# EasyEDA Pro project ProPrj_IRIS_2026-05-03.epro, board PCB1
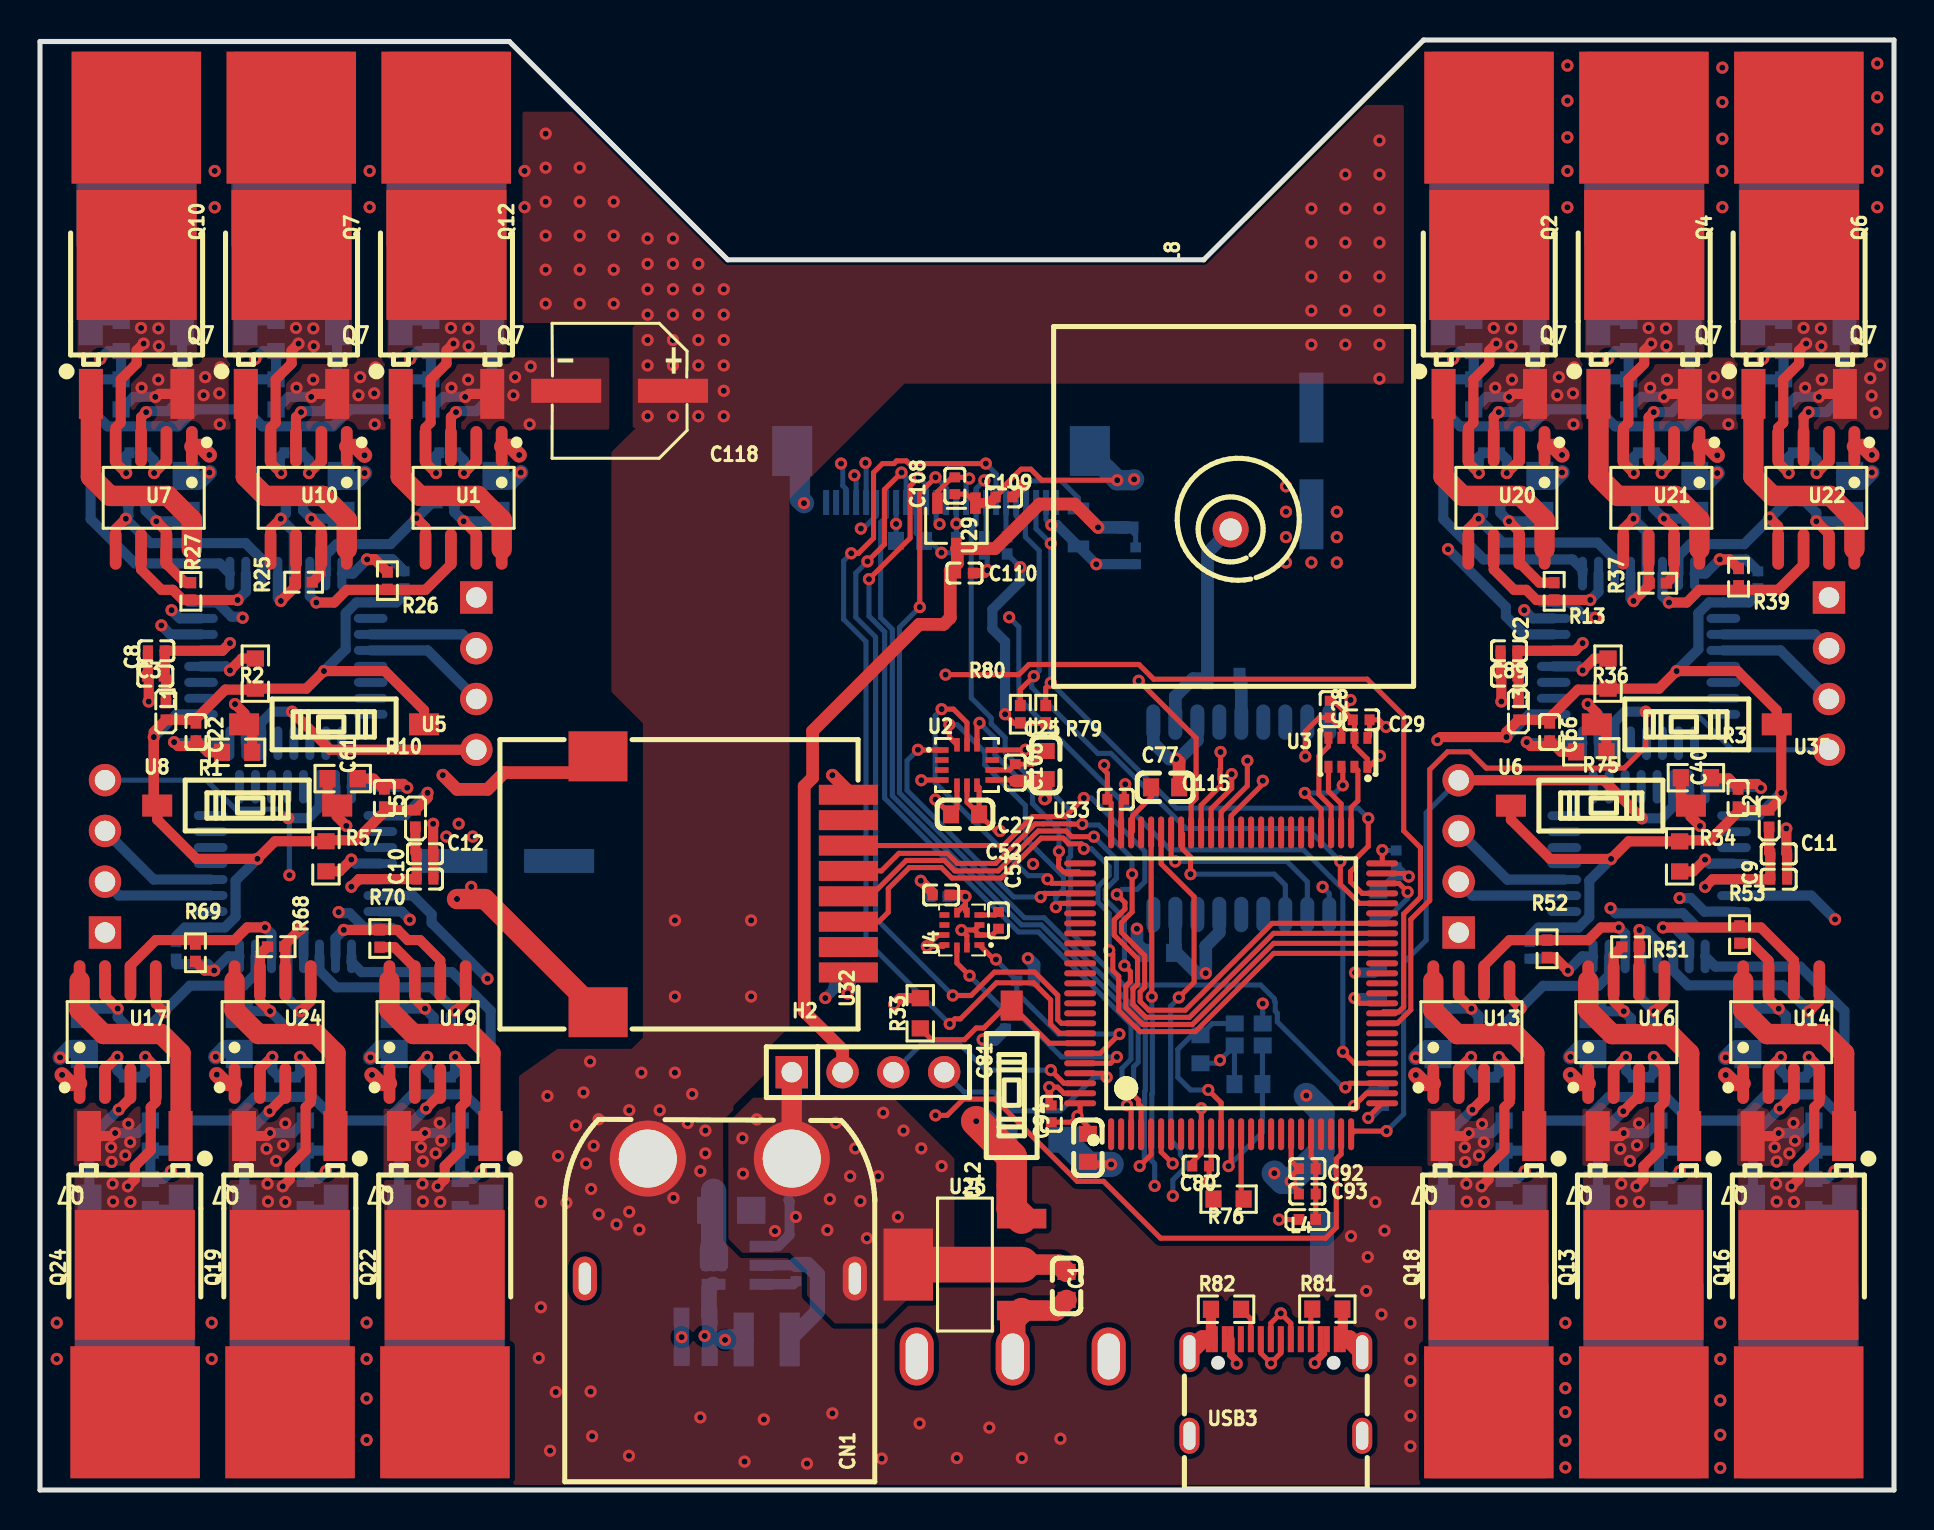
[diagram p2: board, top side]
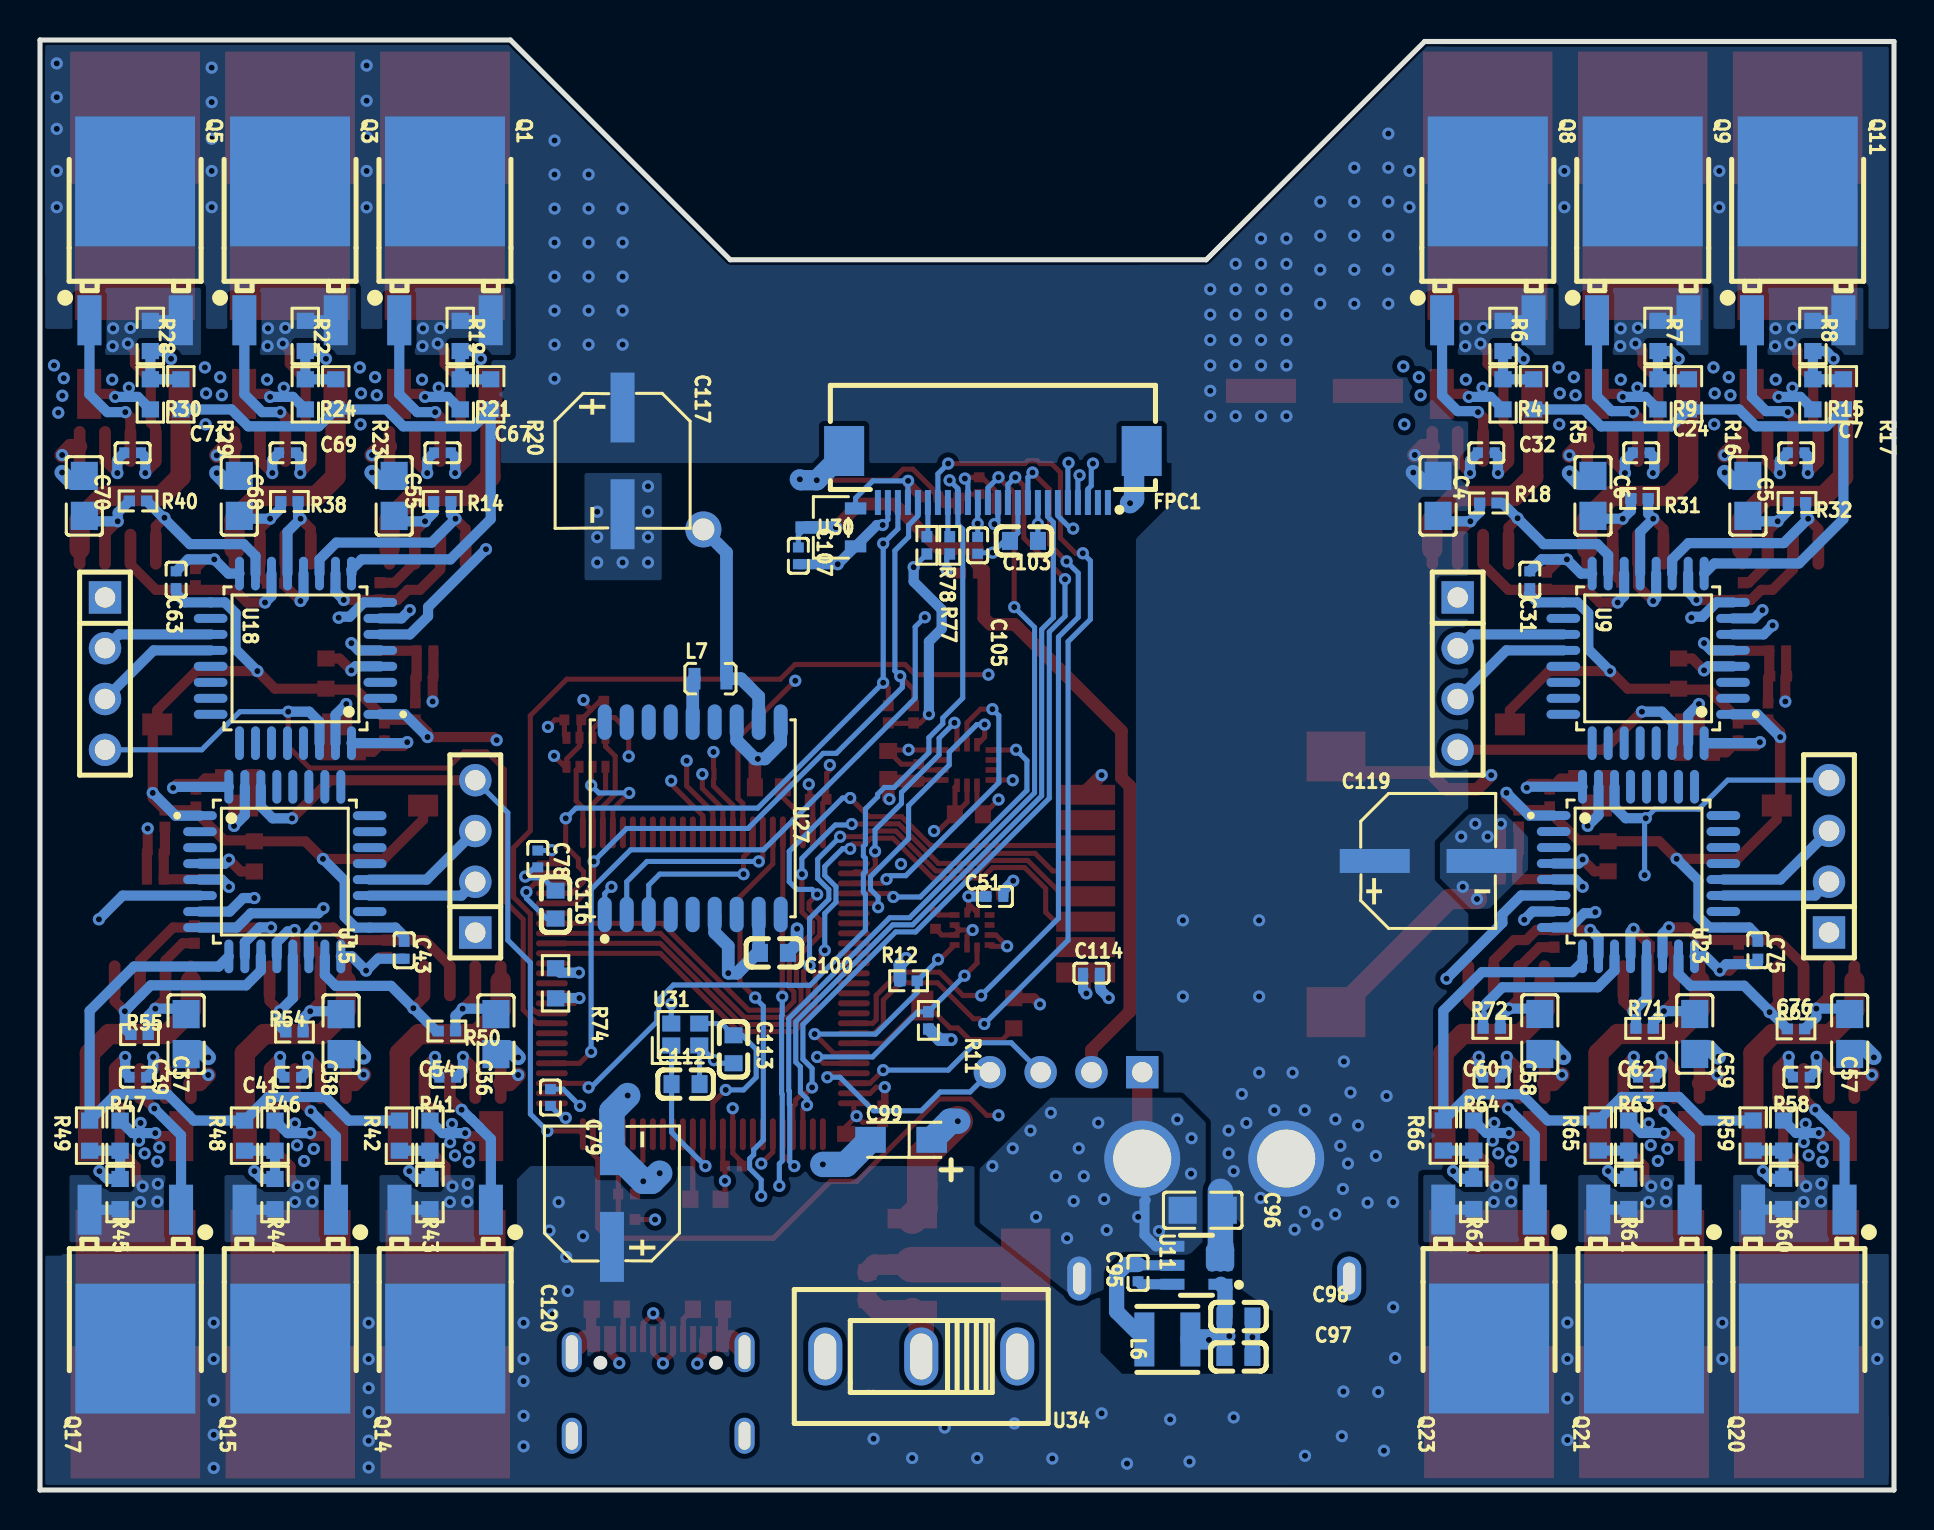
[diagram p3: board, bottom side, seen from below]

Outline 92.71 x 72.54 mm; copper layers: Top Layer, Ground, Power, Bottom Layer. Coordinates in mm from the lower left corner of the outline.
Outline path: 0,72.47 0,0 92.71,0 92.71,72.54 69.19,72.54 58.19,61.54 34.39,61.54 23.47,72.47 0,72.47
Stack: Top Layer 0.035mm Outer layer thickness 1oz / Dielectric1 0.2104mm 7628 RC49% 8.6mil / Ground 0.0152mm Inner layer thickness / Dielectric2 1.065mm 1.1mm H/HOZ Copper / Power 0.0152mm Inner layer thickness / Dielectric3 0.2104mm 7628 RC49% 8.6mil / Bottom Layer 0.035mm Outer layer thickness 1oz

## Design rules (mm)
template: Custom Config
spacing copperThickness1oz (default): track to track 0.102, other pairs 0.152 to 0.3
spacing copperThickness2oz: track to track 0.203, other pairs 0.152 to 0.3
track width copperThickness1oz (default): min 0.127, default 0.254, max 2.54
track width copperThickness2oz: min 0.203, default 0.254, max 2.54
differential pair differentialPair (default): width min 0.127, default 0.254, max 2.54; gap min 0.152, default 0.152
via viaSize (default): diameter min 0.5, default 0.61, max 10; hole min 0.3, default 0.305, max 6.3
net $1I45112\PHASE_U uses copperRegion1
net $1I45112\PHASE_V uses copperRegion1
net $1I45112\PHASE_W uses copperRegion1
net $1I45134\PHASE_U uses copperRegion1
net $1I45134\PHASE_V uses copperRegion1
net 7.4V_BATTERY uses copperRegion1
net $1I45134\PHASE_W uses copperRegion1
net $1I45156\PHASE_U uses copperRegion1
net $1I45156\PHASE_V uses copperRegion1
net $1I45090\PHASE_U uses copperRegion1
net $1I45090\PHASE_V uses copperRegion1
net $1I45090\PHASE_W uses copperRegion1
net $1I45156\PHASE_W uses copperRegion1
pour e4111 uses copperRegion1
pour e397 uses copperRegion1
pour e182 uses copperRegion1
pour e292 uses copperRegion1
pour e393 uses copperRegion1
pour e1338 uses copperRegion1
pour e470 uses copperRegion1
pour e582 uses copperRegion1
pour e701 uses copperRegion1
pour e838 uses copperRegion1
pour e2081 uses copperRegion1
pour e2207 uses copperRegion1
pour e2186 uses copperRegion1
pour e2269 uses copperRegion1
pour e2267 uses copperRegion1
pour e2268 uses copperRegion1
pour e2460 uses copperRegion1
pour e2478 uses copperRegion1
pour e2486 uses copperRegion1
pour e2530 uses copperRegion1
pour e2531 uses copperRegion1
pour e2532 uses copperRegion1
pour e323 uses copperRegion1

## Placement (name value [footprint] x y rotation side)
C1  10uF  [C0603]  51.33 10.21 270 top
C2  1uF  [C0402]  73.46 41.99 0 top
C3  100nF  [C0402]  5.77 40.72 180 top
C4  22uF  [C0805]  22.8 49.73 90 bottom
C5  22uF  [C0805]  7.31 49.73 90 bottom
C6  22uF  [C0805]  15.05 49.73 90 bottom
C7  100nF  [C0402]  4.89 51.89 0 bottom
C8  1uF  [C0402]  5.82 41.99 0 top
C9  1uF  [C0402]  86.94 30.56 180 top
C10  1uF  [C0402]  19.25 30.56 180 top
C11  100nF  [C0402]  86.94 31.83 0 top
C12  100nF  [C0402]  19.25 31.83 0 top
C22  100nF  [C0402]  7.8 37.92 90 top
C24  100nF  [C0402]  12.64 51.89 0 bottom
C25  2.2uF  [C0603]  50.29 36.27 270 top
C27  10nF  [C0603]  46.26 33.8 180 top
C28  100nF  [C0402]  64.52 39.06 90 top
C29  100nF  [C0402]  66.07 38.53 180 top
C31  100nF  [C0402]  18.21 45.54 90 bottom
C32  100nF  [C0402]  20.39 51.89 0 bottom
C36  22uF  [C0805]  69.91 22.81 270 bottom
C37  22uF  [C0805]  85.4 22.81 270 bottom
C38  22uF  [C0805]  77.66 22.81 270 bottom
C39  100nF  [C0402]  87.82 20.65 180 bottom
C40  100nF  [C0402]  84.91 34.62 270 top
C41  100nF  [C0402]  80.07 20.65 180 bottom
C43  100nF  [C0402]  74.5 27 270 bottom
C51  1uF  [C0402]  44.96 29.69 180 bottom
C52  100nF  [C0402]  45.06 29.77 180 top
C53  100nF  [C0402]  47.93 28.5 90 top
C54  100nF  [C0402]  72.32 20.65 180 bottom
C55  22uF  [C0805]  75 49.73 90 bottom
C57  22uF  [C0805]  2.22 22.81 270 bottom
C58  22uF  [C0805]  17.71 22.81 270 bottom
C59  22uF  [C0805]  9.96 22.81 270 bottom
C60  100nF  [C0402]  20.12 20.65 180 bottom
C61  100nF  [C0402]  17.22 34.62 270 top
C62  100nF  [C0402]  12.38 20.65 180 bottom
C63  100nF  [C0402]  85.9 45.54 90 bottom
C66  100nF  [C0402]  75.49 37.92 90 top
C67  100nF  [C0402]  72.59 51.89 0 bottom
C68  22uF  [C0805]  82.75 49.73 90 bottom
C69  100nF  [C0402]  80.33 51.89 0 bottom
C70  22uF  [C0805]  90.49 49.73 90 bottom
C71  100nF  [C0402]  88.08 51.89 0 bottom
C75  100nF  [C0402]  6.81 27 270 bottom
C76  100nF  [C0402]  4.63 20.65 180 bottom
C77  100nF  [C0402]  53.8 34.55 180 top
C78  100nF  [C0402]  67.82 31.57 90 bottom
C79  100nF  [C0402]  67.18 19.63 90 bottom
C80  100nF  [C0402]  58.04 16.2 0 top
C81  100nF  [C0402]  50.57 18.82 270 top
C89  100nF  [C0402]  73.46 40.72 180 top
C92  100nF  [C0402]  63.37 16.08 0 top
C93  1uF  [C0402]  63.37 14.81 0 top
C94  4.7uF  [C0603]  52.4 17.12 270 top
C95  100nF  [C0402]  37.8 10.86 270 bottom
C96  10uF  [C0805]  34.57 13.99 180 bottom
C97  22uF  [C0603]  32.78 6.66 0 bottom
C98  22uF  [C0603]  32.78 8.68 0 bottom
C99  10uF  [CAP-SMD_L3.2-W1.6-RD-C7171]  49.65 17.52 0 bottom
C100  10uF  [C0603]  56.01 26.87 0 bottom
C103  15pF  [C0603]  43.51 47.48 180 bottom
C105  100nF  [C0402]  45.82 47.26 90 bottom
C106  100nF  [C0402]  48.77 35.89 90 top
C107  1uF  [C0402]  54.79 46.74 90 bottom
C108  1uF  [C0402]  45.75 50.24 90 top
C109  1uF  [C0402]  48.2 49.68 0 top
C110  1uF  [C0402]  46.23 45.87 180 top
C112  10pF  [C0603]  60.43 20.31 180 bottom
C113  10pF  [C0603]  58.03 22.05 270 bottom
C114  100nF  [C0402]  40.13 25.86 180 bottom
C115  2.2uF  [C0603]  56.26 35.15 180 top
C116  2.2uF  [C0603]  66.93 29.29 270 bottom
C117  330uF  [CAP-SMD_BD6.3-L6.6-W6.6-LS7.2-FD_3]  63.58 51.49 270 bottom
C118  330uF  [CAP-SMD_BD6.3-L6.6-W6.6-LS7.2-FD_3]  28.98 54.99 180 top
C119  330uF  [CAP-SMD_BD6.3-L6.6-W6.6-LS7.2-FD_3]  23.29 31.47 180 bottom
C120  330uF  [CAP-SMD_BD6.3-L6.6-W6.6-LS7.2-FD_3]  64.11 14.83 90 bottom
CN1  XT60PW-M  [CONN-TH_XT60PW-M]  33.99 13.58 90 top
FPC1  FPC-05F-24PH20  [FPC-SMD_24P-P0.50_FPC-05F-24PH20]  45.06 50.69 0 bottom
H1  HX PH254-01-04-Z-L11.5 straight pin header  [HDR-TH_4P-HX-PH254-01-04-Z-L11.5]  89.46 40.84 270 bottom
H2  HX PH254-01-04-Z-L11.5 straight pin header  [HDR-TH_4P-HX-PH254-01-04-Z-L11.5]  41.4 20.9 0 top
H3  HX PH254-01-04-Z-L11.5 straight pin header  [HDR-TH_4P-HX-PH254-01-04-Z-L11.5]  21.82 40.84 270 bottom
H4  HX PH254-01-04-Z-L11.5 straight pin header  [HDR-TH_4P-HX-PH254-01-04-Z-L11.5]  70.94 31.7 90 bottom
H5  HX PH254-01-04-Z-L11.5 straight pin header  [HDR-TH_4P-HX-PH254-01-04-Z-L11.5]  3.25 31.7 90 bottom
L1  BLM15PD121SN1D  [L0402]  6.3 38.95 270 top
L2  BLM15PD121SN1D  [L0402]  86.46 33.59 90 top
L3  BLM15PD121SN1D  [L0402]  73.94 38.95 270 top
L4  BLM15PD121SN1D  [L0402]  63.37 13.54 0 top
L5  BLM15PD121SN1D  [L0402]  18.77 33.6 90 top
L6  4.7uH  [IND-SMD_L3.0-W3.0-1]  36.34 7.53 180 bottom
L7  47nH  [IND-SMD_L1.8-W1.0]  59.18 40.59 180 bottom
L8  BWGNSCNX18-18W4  [ANT-TH_L18.0-W18.0_C9900026472]  59.54 48.06 0 top
NOREF  -  [Pad_e4444]  80.2 3.89 0 top
NOREF#2  -  [Pad_e3516]  20.25 3.89 0 top
NOREF#3  -  [Pad_e680]  72.46 68.66 180 top
NOREF#4  -  [Pad_e3514]  4.76 3.89 0 top
NOREF#5  -  [Pad_e2996]  12.56 68.66 180 top
NOREF#6  -  [Pad_e3517]  12.5 3.89 0 top
NOREF#7  -  [Pad_e836]  87.95 68.66 180 top
NOREF#8  -  [Pad_e2995]  4.82 68.66 180 top
NOREF#9  -  [Pad_e4443]  87.94 3.89 0 top
NOREF#10  -  [Pad_e4442]  72.45 3.89 0 top
NOREF#11  -  [Pad_e2994]  20.31 68.66 180 top
NOREF#12  -  [Pad_e339]  80.21 68.66 180 top
Q1  IRLR7843TRPBF  [TO-252-3_L6.6-W6.1-P4.57-LS9.9-BR-CW]  72.46 61.99 270 bottom
Q2  IRLR7843TRPBF  [TO-252-3_L6.6-W6.1-P4.57-LS9.9-BR-CW]  72.47 58.31 270 top
Q3  IRLR7843TRPBF  [TO-252-3_L6.6-W6.1-P4.57-LS9.9-BR-CW]  80.21 61.99 270 bottom
Q4  IRLR7843TRPBF  [TO-252-3_L6.6-W6.1-P4.57-LS9.9-BR-CW]  80.22 58.31 270 top
Q5  IRLR7843TRPBF  [TO-252-3_L6.6-W6.1-P4.57-LS9.9-BR-CW]  87.95 61.99 270 bottom
Q6  IRLR7843TRPBF  [TO-252-3_L6.6-W6.1-P4.57-LS9.9-BR-CW]  87.97 58.31 270 top
Q7  IRLR7843TRPBF  [TO-252-3_L6.6-W6.1-P4.57-LS9.9-BR-CW]  12.58 58.31 270 top
Q8  IRLR7843TRPBF  [TO-252-3_L6.6-W6.1-P4.57-LS9.9-BR-CW]  20.31 61.99 270 bottom
Q9  IRLR7843TRPBF  [TO-252-3_L6.6-W6.1-P4.57-LS9.9-BR-CW]  12.56 61.99 270 bottom
Q10  IRLR7843TRPBF  [TO-252-3_L6.6-W6.1-P4.57-LS9.9-BR-CW]  4.83 58.31 270 top
Q11  IRLR7843TRPBF  [TO-252-3_L6.6-W6.1-P4.57-LS9.9-BR-CW]  4.82 61.99 270 bottom
Q12  IRLR7843TRPBF  [TO-252-3_L6.6-W6.1-P4.57-LS9.9-BR-CW]  20.33 58.31 270 top
Q13  IRLR7843TRPBF  [TO-252-3_L6.6-W6.1-P4.57-LS9.9-BR-CW]  80.18 14.23 90 top
Q14  IRLR7843TRPBF  [TO-252-3_L6.6-W6.1-P4.57-LS9.9-BR-CW]  72.45 10.55 90 bottom
Q15  IRLR7843TRPBF  [TO-252-3_L6.6-W6.1-P4.57-LS9.9-BR-CW]  80.2 10.55 90 bottom
Q16  IRLR7843TRPBF  [TO-252-3_L6.6-W6.1-P4.57-LS9.9-BR-CW]  87.93 14.23 90 top
Q17  IRLR7843TRPBF  [TO-252-3_L6.6-W6.1-P4.57-LS9.9-BR-CW]  87.94 10.55 90 bottom
Q18  IRLR7843TRPBF  [TO-252-3_L6.6-W6.1-P4.57-LS9.9-BR-CW]  72.44 14.23 90 top
Q19  IRLR7843TRPBF  [TO-252-3_L6.6-W6.1-P4.57-LS9.9-BR-CW]  12.49 14.24 90 top
Q20  IRLR7843TRPBF  [TO-252-3_L6.6-W6.1-P4.57-LS9.9-BR-CW]  4.76 10.55 90 bottom
Q21  IRLR7843TRPBF  [TO-252-3_L6.6-W6.1-P4.57-LS9.9-BR-CW]  12.5 10.55 90 bottom
Q22  IRLR7843TRPBF  [TO-252-3_L6.6-W6.1-P4.57-LS9.9-BR-CW]  20.24 14.24 90 top
Q23  IRLR7843TRPBF  [TO-252-3_L6.6-W6.1-P4.57-LS9.9-BR-CW]  20.25 10.55 90 bottom
Q24  IRLR7843TRPBF  [TO-252-3_L6.6-W6.1-P4.57-LS9.9-BR-CW]  4.74 14.24 90 top
R1  10kΩ  [R0603]  9.86 36.91 180 top
R2  10kΩ  [R0603]  10.77 40.84 90 top
R3  10kΩ  [R0603]  82.8 35.64 0 top
R4  10kΩ  [R0603]  19.55 54.81 90 bottom
R5  33kΩ  [R0603]  18.03 54.81 90 bottom
R6  33kΩ  [R0603]  19.55 57.73 90 bottom
R7  33kΩ  [R0603]  11.8 57.73 90 bottom
R8  33kΩ  [R0603]  4.06 57.73 90 bottom
R9  10kΩ  [R0603]  11.8 54.81 90 bottom
R10  10kΩ  [R0603]  15.14 35.59 0 top
R11  2.2kΩ  [R0402]  48.29 23.49 90 bottom
R12  2.2kΩ  [R0402]  49.28 25.48 180 bottom
R13  270kΩ  [R0402]  75.72 44.96 90 top
R14  270kΩ  [R0402]  72.59 49.45 0 bottom
R15  10kΩ  [R0603]  4.06 54.81 90 bottom
R16  33kΩ  [R0603]  10.28 54.81 90 bottom
R17  33kΩ  [R0603]  2.53 54.81 90 bottom
R18  100kΩ  [R0402]  20.29 49.38 0 bottom
R19  33kΩ  [R0603]  71.7 57.73 90 bottom
R20  33kΩ  [R0603]  70.17 54.81 90 bottom
R21  10kΩ  [R0603]  71.7 54.81 90 bottom
R22  33kΩ  [R0603]  79.44 57.73 90 bottom
R23  33kΩ  [R0603]  77.92 54.81 90 bottom
R24  10kΩ  [R0603]  79.44 54.81 90 bottom
R25  100kΩ  [R0402]  13.18 45.41 0 top
R26  100kΩ  [R0402]  17.37 45.49 90 top
R27  100kΩ  [R0402]  7.54 44.96 90 top
R28  33kΩ  [R0603]  87.19 57.73 90 bottom
R29  33kΩ  [R0603]  85.67 54.81 90 bottom
R30  10kΩ  [R0603]  87.19 54.81 90 bottom
R31  100kΩ  [R0402]  12.73 49.61 0 bottom
R32  100kΩ  [R0402]  4.85 49.4 0 bottom
R33  10kΩ  [R0603]  44.02 23.85 90 top
R34  10kΩ  [R0603]  81.99 31.7 270 top
R36  10kΩ  [R0603]  78.41 40.84 90 top
R37  270kΩ  [R0402]  80.9 45.36 0 top
R38  270kΩ  [R0402]  80.24 49.45 0 bottom
R39  270kΩ  [R0402]  84.94 45.67 90 top
R40  270kΩ  [R0402]  87.81 49.48 0 bottom
R41  10kΩ  [R0603]  73.21 17.73 270 bottom
R42  33kΩ  [R0603]  74.73 17.73 270 bottom
R43  33kΩ  [R0603]  73.21 14.81 270 bottom
R44  33kΩ  [R0603]  80.96 14.81 270 bottom
R45  33kΩ  [R0603]  88.7 14.81 270 bottom
R46  10kΩ  [R0603]  80.96 17.73 270 bottom
R47  10kΩ  [R0603]  88.7 17.73 270 bottom
R48  33kΩ  [R0603]  82.48 17.73 270 bottom
R49  33kΩ  [R0603]  90.23 17.73 270 bottom
R50  270kΩ  [R0402]  72.36 22.96 180 bottom
R51  270kΩ  [R0402]  79.54 27.18 180 top
R52  270kΩ  [R0402]  75.36 27.08 270 top
R53  270kΩ  [R0402]  84.99 27.79 270 top
R54  270kΩ  [R0402]  79.98 22.91 180 bottom
R55  270kΩ  [R0402]  87.73 22.78 180 bottom
R57  10kΩ  [R0603]  14.3 31.7 270 top
R58  10kΩ  [R0603]  5.52 17.73 270 bottom
R59  33kΩ  [R0603]  7.04 17.73 270 bottom
R60  33kΩ  [R0603]  5.52 14.81 270 bottom
R61  33kΩ  [R0603]  13.27 14.81 270 bottom
R62  33kΩ  [R0603]  21.01 14.81 270 bottom
R63  10kΩ  [R0603]  13.27 17.73 270 bottom
R64  10kΩ  [R0603]  21.01 17.73 270 bottom
R65  33kΩ  [R0603]  14.79 17.73 270 bottom
R66  33kΩ  [R0603]  22.54 17.73 270 bottom
R67  270kΩ  [R0402]  4.9 23.07 180 bottom
R68  270kΩ  [R0402]  11.81 27.18 180 top
R69  270kΩ  [R0402]  7.77 26.88 270 top
R70  270kΩ  [R0402]  16.99 27.59 270 top
R71  270kΩ  [R0402]  12.47 23.09 180 bottom
R72  270kΩ  [R0402]  20.12 23.09 180 bottom
R74  10kΩ  [R0603]  66.93 25.35 90 bottom
R75  10kΩ  [R0603]  77.57 36.93 180 top
R76  10kΩ  [R0603]  59.44 14.55 0 top
R77  1kΩ  [R0402]  47.22 47.26 90 bottom
R78  4.7kΩ  [R0402]  48.36 47.26 90 bottom
R79  2.2kΩ  [R0402]  50.29 38.81 90 top
R80  2.2kΩ  [R0402]  49.02 38.81 90 top
R81  5.1kΩ  [R0603]  64.37 9.05 0 top
R82  5.1kΩ  [R0603]  59.31 9.04 0 top
U1  MIC4605-1YM-TR  [SOIC-8_L4.9-W3.9-P1.27-LS6.0-BL]  21.18 49.64 180 top
U2  ICM-42688-P  [LGA-14_L3.0-W2.5-P0.50-TL]  46.36 36.27 0 top
U3  BMP280  [LGA-8_L2.5-W2.0-P0.65_AMP6127]  65.41 36.91 270 top
U4  LIS3MDLTR  [LGA-12_L2.0-W2.0-P0.50-BL]  46.1 28.02 90 top
U5  2.54-1P TPGT  [SW-SMD_2P-L6.2-W2.5-LS9.4]  14.71 38.3 180 top
U6  2.54-1P TPGT  [SW-SMD_2P-L6.2-W2.5-LS9.4]  78.05 34.24 0 top
U7  MIC4605-1YM-TR  [SOIC-8_L4.9-W3.9-P1.27-LS6.0-BL]  5.69 49.64 180 top
U8  2.54-1P TPGT  [SW-SMD_2P-L6.2-W2.5-LS9.4]  10.36 34.24 0 top
U9  AT32F421K8T7  [LQFP-32_L7.0-W7.0-P0.80-LS9.0-BL]  12.29 41.6 90 bottom
U10  MIC4605-1YM-TR  [SOIC-8_L4.9-W3.9-P1.27-LS6.0-BL]  13.44 49.64 180 top
U11  AP63205WU-7  [TSOT-23-6_L2.9-W1.6-P0.95-LS2.8-BL]  34.88 11.24 90 bottom
U12  2.54-1P TPGT  [SW-SMD_2P-L6.2-W2.5-LS9.4]  48.59 19.74 90 top
U13  MIC4605-1YM-TR  [SOIC-8_L4.9-W3.9-P1.27-LS6.0-BL]  71.58 22.91 0 top
U14  MIC4605-1YM-TR  [SOIC-8_L4.9-W3.9-P1.27-LS6.0-BL]  87.07 22.91 0 top
U15  AT32F421K8T7  [LQFP-32_L7.0-W7.0-P0.80-LS9.0-BL]  80.47 30.94 270 bottom
U16  MIC4605-1YM-TR  [SOIC-8_L4.9-W3.9-P1.27-LS6.0-BL]  79.33 22.91 0 top
U17  MIC4605-1YM-TR  [SOIC-8_L4.9-W3.9-P1.27-LS6.0-BL]  3.89 22.91 0 top
U18  AT32F421K8T7  [LQFP-32_L7.0-W7.0-P0.80-LS9.0-BL]  79.93 41.6 90 bottom
U19  MIC4605-1YM-TR  [SOIC-8_L4.9-W3.9-P1.27-LS6.0-BL]  19.38 22.91 0 top
U20  MIC4605-1YM-TR  [SOIC-8_L4.9-W3.9-P1.27-LS6.0-BL]  73.33 49.64 180 top
U21  MIC4605-1YM-TR  [SOIC-8_L4.9-W3.9-P1.27-LS6.0-BL]  81.08 49.64 180 top
U22  MIC4605-1YM-TR  [SOIC-8_L4.9-W3.9-P1.27-LS6.0-BL]  88.82 49.64 180 top
U23  AT32F421K8T7  [LQFP-32_L7.0-W7.0-P0.80-LS9.0-BL]  12.78 30.94 270 bottom
U24  MIC4605-1YM-TR  [SOIC-8_L4.9-W3.9-P1.27-LS6.0-BL]  11.63 22.91 0 top
U25  MIC39100-3.3WS-TR  [SOT-223-4_L6.5-W3.5-P2.30-LS7.0-BR]  46.25 11.28 0 top
U27  ATGM336H-5N31  [GPSM-SMD_ATGM336H-TR]  60.07 33.6 0 bottom
U29  XC6206-1.2V  [SOT-23-3_L3.0-W1.6-P1.90-LS2.8-BR]  45.83 48.24 90 top
U30  XC6206-2.8V  [SOT-23-3_L2.9-W1.6-P1.90-LS2.8-BR]  53.16 48.16 180 bottom
U31  48MHz  [CRYSTAL-SMD_4P-L2.0-W1.6-BL]  60.44 22.79 180 bottom
U32  E01C-ML01SP4  [COMM-SMD_E01C-ML01SP4]  34.16 30.3 270 top
U33  STM32H743VIT6  [LQFP-100_L14.0-W14.0-P0.50-LS16.0-BL]  59.56 25.35 0 top
U34  SS12D10G5  [SW-TH_SHOU-HAN_SS12D10G4]  48.64 6.68 0 bottom
U35  2.54-1P TPGT  [SW-SMD_2P-L6.2-W2.5-LS9.4]  82.35 38.3 180 top
USB3  KH-TYPE-C-16P  [USB-C-SMD_KH-TYPE-C-16P]  61.8 5.13 0 top

## Footprints (pads in the part's own frame, mm; a bottom-side part is the same pattern mirrored in y, then rotated)
ANT-TH_L18.0-W18.0_C9900026472
  round 1.8 hole 1.1: 1(0,0)
C0402
  rect 0.5x0.54 smd: 1(-0.42,0) 2(0.42,0)
C0603
  rect 0.8x0.9 smd: 1(-0.7,0) 2(0.7,0)
C0805
  rect 1.41x1.35 smd: 1(-1,0) 2(1,0)
CAP-SMD_BD6.3-L6.6-W6.6-LS7.2-FD_3
  rect 3.5x1.2 smd: 1(-2.67,0) 2(2.67,0)
CAP-SMD_L3.2-W1.6-RD-C7171
  rect 1.53x1.296 smd: 1(-1.53,0) 2(1.53,0)
COMM-SMD_E01C-ML01SP4
  rect 1x2.95 smd: 1(4.41,6.26) 2(3.14,6.26) 3(1.87,6.26) 4(0.6,6.26) 5(-0.67,6.26) 6(-1.94,6.26) 7(-3.21,6.26) 8(-4.48,6.26)
  rect 2.5x2.95 smd: 9(-6.4,-6.26) 10(6.4,-6.255)
CONN-TH_XT60PW-M
  round 3.8 hole 2.9: 1(3,-3.6) 2(3,3.6)
  oval 2.2x1.2 hole 1.6x0.6: 3(-3,6.75) 4(-3,-6.75)
CRYSTAL-SMD_4P-L2.0-W1.6-BL
  rect 0.9x0.8 smd: 1(-0.7,-0.55) 2(0.7,-0.55) 3(0.7,0.55) 4(-0.7,0.55)
FPC-SMD_24P-P0.50_FPC-05F-24PH20
  rect 0.3x1.25 smd: 1(-5.75,1.288) 2(-5.25,1.288) 3(-4.75,1.288) 4(-4.25,1.288) 5(-3.75,1.288) 6(-3.25,1.288) 7(-2.75,1.288) 8(-2.25,1.288) 9(-1.75,1.288) 10(-1.25,1.288) 11(-0.75,1.288) 12(-0.25,1.288) 13(0.25,1.288) 14(0.75,1.288) 15(1.25,1.288) 16(1.75,1.288) 17(2.25,1.288) 18(2.75,1.288) 19(3.25,1.288) 20(3.75,1.288) 21(4.25,1.288) 22(4.75,1.288) 23(5.25,1.288) 24(5.75,1.288)
  rect 2x2.5 smd: 25(7.44,-1.288) 26(-7.44,-1.288)
GPSM-SMD_ATGM336H-TR
  oval 0.7x1.773 smd: 1(4.4,4.811) 2(3.3,4.811) 3(2.2,4.811) 4(1.1,4.811) 5(0,4.811) 6(-1.1,4.811) 7(-2.2,4.811) 8(-3.3,4.811) 9(-4.4,4.811) 10(-4.4,-4.811) 11(-3.3,-4.811) 12(-2.2,-4.811) 13(-1.1,-4.811) 14(0,-4.811) 15(1.1,-4.811) 16(2.2,-4.811) 17(3.3,-4.811) 18(4.4,-4.811)
HDR-TH_4P-HX-PH254-01-04-Z-L11.5
  rect 1.62x1.62 hole 1.02: 1(-3.81,0)
  round 1.62 hole 1.02: 2(-1.27,0) 3(1.27,0) 4(3.81,0)
IND-SMD_L1.8-W1.0
  rect 0.6x1.08 smd: 1(-0.8,0) 2(0.8,0)
IND-SMD_L3.0-W3.0-1
  rect 1x2.7 smd: 1(-1.15,0) 2(1.15,0)
L0402
  rect 0.54x0.54 smd: 1(-0.42,0) 2(0.42,0)
LGA-8_L2.5-W2.0-P0.65_AMP6127
  rect 0.6x0.4 smd: 1(0.725,0.975) 2(0.725,0.325) 3(0.725,-0.325) 4(0.725,-0.975) 5(-0.725,-0.975) 6(-0.725,-0.325) 7(-0.725,0.325) 8(-0.725,0.975)
LGA-12_L2.0-W2.0-P0.50-BL
  rect 0.28x0.5 smd: 1(-0.75,-0.875) 2(-0.25,-0.875) 3(0.25,-0.875) 4(0.75,-0.875) 7(0.75,0.875) 8(0.25,0.875) 9(-0.25,0.875) 10(-0.75,0.875)
  rect 0.5x0.28 smd: 5(0.875,-0.25) 6(0.875,0.25) 11(-0.875,0.25) 12(-0.875,-0.25)
LGA-14_L3.0-W2.5-P0.50-TL
  rect 0.675x0.28 smd: 1(-1.262,0.75) 2(-1.262,0.25) 3(-1.262,-0.25) 4(-1.262,-0.75) 8(1.262,-0.75) 9(1.262,-0.25) 10(1.262,0.25) 11(1.262,0.75)
  rect 0.28x0.675 smd: 5(-0.5,-1.012) 6(0,-1.012) 7(0.5,-1.012) 12(0.5,1.012) 13(0,1.012) 14(-0.5,1.012)
LQFP-32_L7.0-W7.0-P0.80-LS9.0-BL
  oval 0.448x1.684 smd: 1(-2.8,-4.242) 2(-2,-4.242) 3(-1.2,-4.242) 4(-0.4,-4.242) 5(0.4,-4.242) 6(1.2,-4.242) 7(2,-4.242) 8(2.8,-4.242) 17(2.8,4.242) 18(2,4.242) 19(1.2,4.242) 20(0.4,4.242) 21(-0.4,4.242) 22(-1.2,4.242) 23(-2,4.242) 24(-2.8,4.242)
  oval 1.684x0.448 smd: 9(4.242,-2.8) 10(4.242,-2) 11(4.242,-1.2) 12(4.242,-0.4) 13(4.242,0.4) 14(4.242,1.2) 15(4.242,2) 16(4.242,2.8) 25(-4.242,2.8) 26(-4.242,2) 27(-4.242,1.2) 28(-4.242,0.4) 29(-4.242,-0.4) 30(-4.242,-1.2) 31(-4.242,-2) 32(-4.242,-2.8)
LQFP-100_L14.0-W14.0-P0.50-LS16.0-BL
  oval 0.3x1.6 smd: 1(-6,-7.55) 2(-5.5,-7.55) 3(-5,-7.55) 4(-4.5,-7.55) 5(-4,-7.55) 6(-3.5,-7.55) 7(-3,-7.55) 8(-2.5,-7.55) 9(-2,-7.55) 10(-1.5,-7.55) 11(-1,-7.55) 12(-0.5,-7.55) 13(0,-7.55) 14(0.5,-7.55) 15(1,-7.55) 16(1.5,-7.55) 17(2,-7.55) 18(2.5,-7.55) 19(3,-7.55) 20(3.5,-7.55) 21(4,-7.55) 22(4.5,-7.55) 23(5,-7.55) 24(5.5,-7.55) 25(6,-7.55) 51(6,7.55) 52(5.5,7.55) 53(5,7.55) 54(4.5,7.55) 55(4,7.55) 56(3.5,7.55) 57(3,7.55) 58(2.5,7.55) 59(2,7.55) 60(1.5,7.55) 61(1,7.55) 62(0.5,7.55) 63(0,7.55) 64(-0.5,7.55) 65(-1,7.55) 66(-1.5,7.55) 67(-2,7.55) 68(-2.5,7.55) 69(-3,7.55) 70(-3.5,7.55) 71(-4,7.55) 72(-4.5,7.55) 73(-5,7.55) 74(-5.5,7.55) 75(-6,7.55)
  oval 1.6x0.3 smd: 26(7.55,-6) 27(7.55,-5.5) 28(7.55,-5) 29(7.55,-4.5) 30(7.55,-4) 31(7.55,-3.5) 32(7.55,-3) 33(7.55,-2.5) 34(7.55,-2) 35(7.55,-1.5) 36(7.55,-1) 37(7.55,-0.5) 38(7.55,0) 39(7.55,0.5) 40(7.55,1) 41(7.55,1.5) 42(7.55,2) 43(7.55,2.5) 44(7.55,3) 45(7.55,3.5) 46(7.55,4) 47(7.55,4.5) 48(7.55,5) 49(7.55,5.5) 50(7.55,6) 76(-7.55,6) 77(-7.55,5.5) 78(-7.55,5) 79(-7.55,4.5) 80(-7.55,4) 81(-7.55,3.5) 82(-7.55,3) 83(-7.55,2.5) 84(-7.55,2) 85(-7.55,1.5) 86(-7.55,1) 87(-7.55,0.5) 88(-7.55,0) 89(-7.55,-0.5) 90(-7.55,-1) 91(-7.55,-1.5) 92(-7.55,-2) 93(-7.55,-2.5) 94(-7.55,-3) 95(-7.55,-3.5) 96(-7.55,-4) 97(-7.55,-4.5) 98(-7.55,-5) 99(-7.55,-5.5) 100(-7.55,-6)
Pad_e339
  custom 6.477x6.604 smd: 1(0,0)
Pad_e680
  custom 6.477x6.604 smd: 1(0,0)
Pad_e836
  custom 6.477x6.604 smd: 1(0,0)
Pad_e2994
  custom 6.477x6.604 smd: 1(0,0)
Pad_e2995
  custom 6.477x6.604 smd: 1(0,0)
Pad_e2996
  custom 6.477x6.604 smd: 1(0,0)
Pad_e3514
  custom 6.477x6.604 smd: 1(0,0)
Pad_e3516
  custom 6.477x6.604 smd: 1(0,0)
Pad_e3517
  custom 6.477x6.604 smd: 1(0,0)
Pad_e4442
  custom 6.477x6.604 smd: 1(0,0)
Pad_e4443
  custom 6.477x6.604 smd: 1(0,0)
Pad_e4444
  custom 6.477x6.604 smd: 1(0,0)
R0402
  rect 0.566x0.54 smd: 1(-0.433,0) 2(0.433,0)
R0603
  rect 0.806x0.864 smd: 1(-0.753,0) 2(0.753,0)
SOIC-8_L4.9-W3.9-P1.27-LS6.0-BL
  oval 0.588x2.045 smd: 1(-1.905,-2.57) 2(-0.635,-2.57) 3(0.635,-2.57) 4(1.905,-2.57) 5(1.905,2.57) 6(0.635,2.57) 7(-0.635,2.57) 8(-1.905,2.57)
SOT-23-3_L2.9-W1.6-P1.90-LS2.8-BR
  rect 1.07x0.6 smd: 1(1.235,-0.95) 2(1.235,0.95) 3(-1.235,0)
SOT-23-3_L3.0-W1.6-P1.90-LS2.8-BR
  rect 1.07x0.532 smd: 1(1.135,-0.95) 2(1.135,0.95) 3(-1.135,0)
SOT-223-4_L6.5-W3.5-P2.30-LS7.0-BR
  rect 2.47x0.98 smd: 1(2.835,-2.3) 2(2.835,0) 3(2.835,2.3)
  rect 2.47x3.6 smd: 4(-2.835,0)
SW-SMD_2P-L6.2-W2.5-LS9.4
  rect 1.5x1.1 smd: 1(-4.5,0) 2(4.5,0)
SW-TH_SHOU-HAN_SS12D10G4
  oval 1.7x2.9 hole 1.1x2.3: 1(-4.8,0) 2(0,0) 3(4.8,0)
TO-252-3_L6.6-W6.1-P4.57-LS9.9-BR-CW
  rect 2.5x1.2 smd: 1(3.475,-2.286) 3(3.475,2.286)
  rect 6.5x6 smd: 2(-3.475,0)
TSOT-23-6_L2.9-W1.6-P0.95-LS2.8-BL
  rect 0.55x1.2 smd: 1(-0.95,-1.2) 2(0,-1.2) 3(0.95,-1.2) 4(0.95,1.2) 5(0,1.2) 6(-0.95,1.2)
USB-C-SMD_KH-TYPE-C-16P
  oval 1x2 hole 0.6x1.7: 1(-4.32,1.765) 2(4.32,1.765)
  oval 1x1.8 hole 0.6x1.4: 3(-4.32,-2.415) 4(4.32,-2.415)
  rect 0.3x1.3 smd: A1(-3.35,2.415) A4(-2.55,2.415) A5(-1.25,2.415) A6(-0.25,2.415) A7(0.25,2.415) A8(1.25,2.415) A9(2.55,2.415) A12(3.35,2.415) B1(3.05,2.415) B4(2.25,2.415) B5(1.75,2.415) B6(0.75,2.415) B7(-0.75,2.415) B8(-1.75,2.415) B9(-2.25,2.415) B12(-3.05,2.415)

## Nets
1.2V: C108.2 FPC1.15 U29.2
2.8V: C109.2 FPC1.21 U30.2
3V3: C22.2 C25.2 C27.2 C28.1 C29.1 C31.1 C40.2 C43.1 C51.1 C52.1 C61.2 C63.1 C66.2 C75.1 C77.2 C78.2 C79.2 C80.2 C81.2 C94.1 C99.1 C100.2 C105.2 C106.1 C114.1 FPC1.14 L1.2 L2.2 L3.2 L4.1 L5.2 R2.1 R11.1 R12.1 R34.1 R36.1 R57.1 R76.1 R78.1 R79.1 R80.1 U2.5 U2.8 U3.6 U3.8 U4.5 U4.6 U4.9 U4.10 U5.1 U6.1 U8.1 U9.1 U9.17 U12.1 U15.1 U15.17 U18.1 U18.17 U23.1 U23.17 U25.3 U27.6 U27.8 U32.1 U33.6 U33.11 U33.27 U33.50 U33.75 U33.100 U35.1
5V_USB: U34.3 USB3.A4 USB3.A9 USB3.B4 USB3.B9
7.4V_BATTERY: C4.2 C5.2 C6.2 C36.2 C37.2 C38.2 C55.2 C57.2 C58.2 C59.2 C68.2 C70.2 C96.2 C117.1 C118.1 C119.1 C120.1 CN1.2 Q1.2 Q3.2 Q5.2 Q8.2 Q9.2 Q11.2 Q14.2 Q15.2 Q17.2 Q20.2 Q21.2 Q23.2 U1.1 U7.1 U10.1 U11.2 U11.3 U13.1 U14.1 U16.1 U17.1 U19.1 U20.1 U21.1 U22.1 U24.1
+5V: C1.2 C107.2 C110.2 H2.2 U25.1 U29.3 U30.3 U34.2
GND: C1.1 C2.1 C3.2 C4.1 C5.1 C6.1 C8.1 C9.1 C10.1 C11.2 C12.2 C22.1 C25.1 C27.1 C28.2 C29.2 C31.2 C36.1 C37.1 C38.1 C40.1 C43.2 C51.2 C52.2 C53.1 C55.1 C57.1 C58.1 C59.1 C61.1 C63.2 C66.1 C68.1 C70.1 C75.2 C77.1 C78.1 C79.1 C80.1 C81.1 C89.2 C92.1 C93.1 C94.2 C96.1 C97.1 C98.1 C99.2 C100.1 C103.1 C105.1 C106.2 C107.1 C108.1 C109.1 C110.1 C112.2 C113.2 C114.2 C115.1 C116.1 C117.2 C118.2 C119.2 C120.2 CN1.1 CN1.3 CN1.4 FPC1.10 FPC1.23 FPC1.25 FPC1.26 H1.1 H2.1 H3.1 H4.1 H5.1 Q2.3 Q4.3 Q6.3 Q7.3 Q10.3 Q12.3 Q13.3 Q16.3 Q18.3 Q19.3 Q22.3 Q24.3 R1.2 R3.2 R4.1 R9.1 R10.2 R13.2 R14.2 R15.1 R18.2 R21.1 R24.1 R25.2 R26.2 R27.2 R30.1 R31.2 R32.2 R33.2 R37.2 R38.2 R39.2 R40.2 R41.1 R46.1 R47.1 R50.2 R51.2 R52.2 R53.2 R54.2 R55.2 R58.1 R63.1 R64.1 R67.2 R68.2 R69.2 R70.2 R71.2 R72.2 R74.2 R75.2 R77.1 R81.2 R82.1 U1.7 U2.6 U2.7 U2.9 U2.11 U3.1 U3.7 U4.2 U4.3 U4.12 U7.7 U9.16 U9.32 U10.7 U11.4 U13.7 U14.7 U15.16 U15.32 U16.7 U17.7 U18.16 U18.32 U19.7 U20.7 U21.7 U22.7 U23.16 U23.32 U24.7 U25.2 U25.4 U27.1 U27.10 U27.12 U29.1 U30.1 U31.2 U31.4 U32.8 U32.9 U32.10 U33.10 U33.19 U33.26 U33.49 U33.74 U33.99 USB3.1 USB3.2 USB3.3 USB3.4 USB3.A1 USB3.A12 USB3.B1 USB3.B12
VDDA: C92.2 C93.2 L4.2 U33.21
$1I45090\$1N2345: Q5.1 U22.3
$1I45090\$1N2351: Q4.1 U21.8
$1I45090\$1N2355: C69.2 U21.2
$1I45090\$1N2357: Q3.1 U21.3
$1I45090\$1N2360: Q2.1 U20.8
$1I45090\$1N2369: C67.2 U20.2
$1I45090\$1N2370: Q1.1 U20.3
$1I45090\$1N2388: R36.2 U18.4
$1I45090\$1N2393: C71.2 U22.2
$1I45090\$1N2396: Q6.1 U22.8
$1I45090\$1N2406: C2.2 C89.1 L3.1 U18.5
$1I45090\A_REF: R20.1 R23.1 R29.1 U18.9
$1I45090\AU: R19.1 R20.2 R21.2 U18.6
$1I45090\AV: R22.1 R23.2 R24.2 U18.7
$1I45090\AW: R28.1 R29.2 R30.2 U18.8
$1I45090\BOOT0_ESC: R75.1 U18.31 U35.2
$1I45090\PHASE_U: C67.1 NOREF#3.1 Q1.3 Q2.2 R19.2 U20.4
$1I45090\PHASE_V: C69.1 NOREF#12.1 Q3.3 Q4.2 R22.2 U21.4
$1I45090\PHASE_W: C71.1 NOREF#7.1 Q5.3 Q6.2 R28.2 U22.4
$1I45090\UH: R14.1 U18.11 U20.5
$1I45090\UL: R13.1 U18.10 U20.6
$1I45090\USART1_RX: H1.3 U18.20
$1I45090\USART1_TX: H1.2 U18.19
$1I45090\VH: R38.1 U18.13 U21.5
$1I45090\VL: R37.1 U18.12 U21.6
$1I45090\WH: R40.1 U18.15 U22.5
$1I45090\WL: R39.1 U18.14 U22.6
$1I45112\$1N2345: Q8.1 U1.3
$1I45112\$1N2351: Q7.1 U10.8
$1I45112\$1N2355: C24.2 U10.2
$1I45112\$1N2357: Q9.1 U10.3
$1I45112\$1N2360: Q10.1 U7.8
$1I45112\$1N2369: C7.2 U7.2
$1I45112\$1N2370: Q11.1 U7.3
$1I45112\$1N2388: R2.2 U9.4
$1I45112\$1N2393: C32.2 U1.2
$1I45112\$1N2396: Q12.1 U1.8
$1I45112\$1N2406: C3.1 C8.2 L1.1 U9.5
$1I45112\A_REF: R5.1 R16.1 R17.1 U9.9
$1I45112\AU: R8.1 R15.2 R17.2 U9.6
$1I45112\AV: R7.1 R9.2 R16.2 U9.7
$1I45112\AW: R4.2 R5.2 R6.1 U9.8
$1I45112\BOOT0_ESC: R1.1 U5.2 U9.31
$1I45112\PHASE_U: C7.1 NOREF#8.1 Q10.2 Q11.3 R8.2 U7.4
$1I45112\PHASE_V: C24.1 NOREF#5.1 Q7.2 Q9.3 R7.2 U10.4
$1I45112\PHASE_W: C32.1 NOREF#11.1 Q8.3 Q12.2 R6.2 U1.4
$1I45112\UH: R32.1 U7.5 U9.11
$1I45112\UL: R27.1 U7.6 U9.10
$1I45112\USART1_RX: H3.3 U9.20
$1I45112\USART1_TX: H3.2 U9.19
$1I45112\VH: R31.1 U9.13 U10.5
$1I45112\VL: R25.1 U9.12 U10.6
$1I45112\WH: R18.1 U1.5 U9.15
$1I45112\WL: R26.1 U1.6 U9.14
$1I45134\$1N2345: Q14.1 U13.3
$1I45134\$1N2351: Q13.1 U16.8
$1I45134\$1N2355: C41.2 U16.2
$1I45134\$1N2357: Q15.1 U16.3
$1I45134\$1N2360: Q16.1 U14.8
$1I45134\$1N2369: C39.2 U14.2
$1I45134\$1N2370: Q17.1 U14.3
$1I45134\$1N2388: R34.2 U15.4
$1I45134\$1N2393: C54.2 U13.2
$1I45134\$1N2396: Q18.1 U13.8
$1I45134\$1N2406: C9.2 C11.1 L2.1 U15.5
$1I45134\A_REF: R42.1 R48.1 R49.1 U15.9
$1I45134\AU: R45.1 R47.2 R49.2 U15.6
$1I45134\AV: R44.1 R46.2 R48.2 U15.7
$1I45134\AW: R41.2 R42.2 R43.1 U15.8
$1I45134\BOOT0_ESC: R3.1 U6.2 U15.31
$1I45134\PHASE_U: C39.1 NOREF#9.1 Q16.2 Q17.3 R45.2 U14.4
$1I45134\PHASE_V: C41.1 NOREF.1 Q13.2 Q15.3 R44.2 U16.4
$1I45134\PHASE_W: C54.1 NOREF#10.1 Q14.3 Q18.2 R43.2 U13.4
$1I45134\UH: R55.1 U14.5 U15.11
$1I45134\UL: R53.1 U14.6 U15.10
$1I45134\USART1_RX: H4.3 U15.20
$1I45134\USART1_TX: H4.2 U15.19
$1I45134\VH: R54.1 U15.13 U16.5
$1I45134\VL: R51.1 U15.12 U16.6
$1I45134\WH: R50.1 U13.5 U15.15
$1I45134\WL: R52.1 U13.6 U15.14
$1I45156\$1N2345: Q20.1 U17.3
$1I45156\$1N2351: Q19.1 U24.8
$1I45156\$1N2355: C62.2 U24.2
$1I45156\$1N2357: Q21.1 U24.3
$1I45156\$1N2360: Q22.1 U19.8
$1I45156\$1N2369: C60.2 U19.2
$1I45156\$1N2370: Q23.1 U19.3
$1I45156\$1N2388: R57.2 U23.4
$1I45156\$1N2393: C76.2 U17.2
$1I45156\$1N2396: Q24.1 U17.8
$1I45156\$1N2406: C10.2 C12.1 L5.1 U23.5
$1I45156\A_REF: R59.1 R65.1 R66.1 U23.9
$1I45156\AU: R62.1 R64.2 R66.2 U23.6
$1I45156\AV: R61.1 R63.2 R65.2 U23.7
$1I45156\AW: R58.2 R59.2 R60.1 U23.8
$1I45156\BOOT0_ESC: R10.1 U8.2 U23.31
$1I45156\PHASE_U: C60.1 NOREF#2.1 Q22.2 Q23.3 R62.2 U19.4
$1I45156\PHASE_V: C62.1 NOREF#6.1 Q19.2 Q21.3 R61.2 U24.4
$1I45156\PHASE_W: C76.1 NOREF#4.1 Q20.3 Q24.2 R60.2 U17.4
$1I45156\UH: R72.1 U19.5 U23.11
$1I45156\UL: R70.1 U19.6 U23.10
$1I45156\USART1_RX: H5.3 U23.20
$1I45156\USART1_TX: H5.2 U23.19
$1I45156\VH: R71.1 U23.13 U24.5
$1I45156\VL: R68.1 U23.12 U24.6
$1I45156\WH: R67.1 U17.5 U23.15
$1I45156\WL: R69.1 U17.6 U23.14
BOOT0: R33.1 U12.2 U33.94
BOOT1: R74.1 U33.36
CAM_RST: FPC1.19 R78.2
CAM_XCLK: FPC1.12 U33.67
DCMI_0: FPC1.6 U33.63
DCMI_1: FPC1.4 U33.64
DCMI_2: FPC1.3 U33.65
DCMI_3: FPC1.5 U33.66
DCMI_4: FPC1.7 U33.3
DCMI_5: FPC1.9 U33.92
DCMI_6: FPC1.11 U33.4
DCMI_7: FPC1.13 U33.5
DCMI_HSYNC: FPC1.16 U33.28
DCMI_PXLCLK: C103.2 FPC1.8 U33.30
DCMI_VSYNC: FPC1.18 U33.93
DM: U33.70 USB3.A7 USB3.B7
DP: U33.71 USB3.A6 USB3.B6
E01_CE: U32.2
E01_IRQ: U32.7
GPS_RX_MCU_TX: U27.3 U33.68
GPS_TX_MCU_RX: U27.2 U33.69
I2C1_SCLK: R12.2 U4.1 U33.95
I2C1_SDA: R11.2 U4.11 U33.96
I2C2_SCLK: FPC1.20 R80.2 U33.46
I2C2_SDA: FPC1.22 R79.2 U33.47
IMU_INT: U2.4
MOTOR1: H1.4 U18.30 U33.34
MOTOR2: H3.4 U9.30 U33.35
MOTOR3: H5.4 U23.30 U33.24
MOTOR4: H4.4 U15.30 U33.25
RADIO_RX: H2.4 U33.97
RADIO_TX: H2.3 U33.98
SPI2_CS: U3.2 U33.51
SPI2_MISO: U3.5 U33.53
SPI2_MOSI: U3.3 U33.54
SPI2_SCLK: U3.4 U33.52
SPI3_CS: U2.12 U33.77
SPI3_MISO: U2.1 U33.79
SPI3_MOSI: U2.14 U33.80
SPI3_SCLK: U2.13 U33.78
SPI4_CS: U32.3 U33.41
SPI4_MISO: U32.6 U33.43
SPI4_MOSI: U32.5 U33.44
SPI4_SCLK: U32.4 U33.42
XI_HS: C113.1 U31.3 U33.12
XO_HS: C112.1 U31.1 U33.13
$1N17368: C97.2 C98.2 L6.2 U11.1 U34.1
$1N17546: C95.1 L6.1 U11.5
$1N56559: C95.2 U11.6
$1N79325: L7.2 L8.1 U27.11
$1N79329: L7.1 U27.14
$1N81168: FPC1.17 R77.2
$1N85586: R81.1 USB3.B5
$1N85625: R82.2 USB3.A5
$1N96765: R76.2 U33.14
$1N102666: C115.2 U33.73
$1N105569: C116.2 U33.48
$1N119973: C53.2 U4.4

Pads without a net: FPC1 1 2 24; U2 2 3 10; U4 7 8; U9 2 3 18 21 22 23 24 25 26 27 28 29; U15 2 3 18 21 22 23 24 25 26 27 28 29; U18 2 3 18 21 22 23 24 25 26 27 28 29; U23 2 3 18 21 22 23 24 25 26 27 28 29; U27 4 5 7 9 13 15 16 17 18; U33 1 2 7 8 9 15 16 17 18 20 22 23 29 31 32 33 37 38 39 40 45 55 56 57 58 59 60 61 62 72 76 81 82 83 84 85 86 87 88 89 90 91; USB3 A8 B8

## Via types
v1: diameter 0.61, hole 0.305, Top Layer to Bottom Layer, 610 vias

## Routing (per net, layer and track width the routed paths; a pad name or vN(x,y) marks a point on that pad's centre or on a via; arc(x,y) is an arc through that point)
1.2V: length 3.8
  Top Layer w0.254: v1(46.46,50.6) 46.4,50.66 C108.2 45.73,50.67 45.61,50.67 44.88,49.93 U29.2
  Bottom Layer w0.254: FPC1.15 46.31,50.45 v1(46.46,50.6)
2.8V: length 5.7
  Top Layer w0.508: C109.2 49.3,50.36 v1(49.3,50.49)
  Bottom Layer w0.254: FPC1.21 49.31,50.48 v1(49.3,50.49) 51.06,50.49 51.93,49.62 U30.2
3V3: length 209.6
  Top Layer w0.254: v1(61.96,13.53) 62.94,13.53 L4.1 ; 65.08,37.63 65.08,38.08 C28.1 63.97,38.64 63.27,37.95 v1(63.27,36.7) ; v1(48.26,38.81) 48.72,38.35 50.27,38.35 R79.1 ; U4.10 45.16,27.2 v1(44.35,27.2) 44.91,27.77 U4.9 ; v1(51.88,18.71) 51.57,18.4 C81.2 ; v1(51.88,18.71) 52.4,18.18 C94.1 ; v1(51.88,18.71) 52.01,18.84 U33.100 ; U33.6 56.06,16.91 v1(56.64,16.33) ; v1(46.28,29.69) 46.28,29.32 ; 46.28,29.32 46.28,28.96 U4.5 ; 46.28,29.32 U4.6 ; R76.1 58.67,14.55 58.46,14.77 v1(58.46,15.47) C80.2 58.56,16.31 U33.11 ; U3.8 66.49,37.74 C29.1 66.95,38.53 v1(67.31,38.18) ; v1(53.21,36.27) 53.21,36.02 53.38,35.86 C77.2 53.56,34.37 U33.75 ; C106.1 48.72,35.52 U2.8 ; v1(44.78,34.54) 45.52,33.8 C27.2 45.86,34.1 U2.5 ; U33.50 67.12,31.36 v1(67.12,32.01) ; v1(65.71,19.22) 66.34,19.85 U33.27
  Top Layer w0.508: 5.69,34.42 v1(5.69,37.67) ; 5.69,34.42 U8.1 ; 5.69,34.42 v1(5.69,37.67) ; v1(5.69,37.67) 5.69,37.92 L1.2 7.76,38.53 9.27,40.04 10.72,40.04 R2.1 13.32,40.09 v1(14.2,40.97) 17.25,40.97 19.21,39.01 U5.1 ; v1(40.39,24.84) 40.42,24.88 40.42,25.89 ; C52.1 46.2,29.77 v1(46.28,29.69) ; U8.1 5.64,34.47 ; U8.1 5.86,33.54 7.82,31.58 v1(10.87,31.58) 11.75,32.46 R57.1 14.35,32.51 15.8,32.51 17.31,34.02 L5.2 19.38,34.63 v1(19.38,34.88) ; v1(69.88,37.52) 70.03,37.67 v1(73.33,37.67) 73.33,37.92 L3.2 75.4,38.53 76.91,40.04 78.36,40.04 R36.1 80.96,40.09 v1(81.84,40.97) 84.89,40.97 86.85,39.01 U35.1 87.07,38.08 v1(87.07,34.87) 87.07,34.62 L2.2 85,34.01 83.49,32.5 82.04,32.5 R34.1 79.44,32.45 v1(78.56,31.57) 75.51,31.57 73.55,33.53 U6.1
  Top Layer w0.635: C106.1 50.19,35.47 C25.2 50.29,34.62 v1(50.24,34.57)
  Top Layer w1.524: v1(46.82,18.45) 48.59,16.68 U12.1 48.59,14.08 U25.3
  Power w0.508: v1(45.82,48.35) 46.84,48.35 v1(49.02,46.17)
  Power w1.016: v1(19.38,34.88) 19.96,34.29 37.16,34.29 38.1,33.35
  Bottom Layer w0.254: v1(67.12,32.01) 67.14,31.99 C78.2 ; C79.2 66.55,20.05 v1(65.71,19.22) ; C105.2 v1(45.82,48.35) 45.82,49.39 FPC1.14 ; R78.1 v1(49.02,46.17)
  Bottom Layer w0.508: v1(78.56,31.57) 77.47,30.48 77.47,28.68 76.93,28.14 U15.17 74.94,28.14 74.5,27.7 ; v1(49.02,46.17) 49.02,45.45 47.63,44.05 47.63,43.08 48.26,42.44 v1(48.26,38.81) ; v1(73.33,37.67) 74.47,38.8 75.69,38.8 ; U9.1 6.83,38.8 v1(5.69,37.67) ; 18.26,44.84 17.83,44.4 U9.17 15.83,44.4 15.29,43.87 15.29,42.06 v1(14.2,40.97) ; 6.81,27.7 7.24,28.14 U23.17 9.24,28.14 9.78,28.68 9.78,30.49 v1(10.87,31.58) ; v1(81.84,40.97) 82.93,42.06 82.93,43.87 83.47,44.4 U18.17 85.47,44.4 85.9,44.84 ; v1(40.39,24.84) 40.55,25.01 C114.1 ; v1(87.07,34.87) 85.93,33.74 U15.1 ; v1(46.28,29.69) C51.1 ; U23.1 18.24,33.74 v1(19.38,34.88)
  Bottom Layer w0.635: R12.1 49.71,26.29 v1(49.4,26.6) ; 48.23,23.04 47.73,22.53 v1(47.14,22.53) ; U27.8 56.77,26.94 57.85,25.86 v1(58.29,25.86) 58.29,27.21 58.97,27.89 U27.6
  Bottom Layer w1.27: C99.1 47.19,18.45 v1(46.82,18.45)
5V_USB: length 15.2
  Top Layer w0.254: 59.25,7.55 59.55,7.55
  Top Layer w0.381: 59.55,7.55 59.55,6.76 59.84,6.47 v1(59.84,6.32) ; 64.17,6.9 64.17,6.83 63.74,6.4 v1(63.74,6.35)
  Power w1.27: 63.55,6.47 63.55,6.2 62.46,5.11 59.76,5.11 ; 59.76,5.11 60.05,5.39 60.05,6.38 ; 59.76,5.11 56.95,5.11 55.37,6.68 U34.3
7.4V_BATTERY: length 255.7
  Top Layer w0.762: U17.1 1.53,20.34 v1(1.11,20.77) ; U21.1 83.43,52.21 v1(83.87,51.76) ; U7.1 8.04,52.21 v1(8.47,51.78) ; v1(8.84,20.78) 9.28,20.34 U24.1 ; U22.1 91.18,52.21 v1(91.6,51.78) ; v1(16.23,51.76) 15.79,52.21 U10.1 ; v1(23.96,51.78) 23.54,52.21 U1.1 ; v1(68.8,20.76) 69.22,20.34 U13.1 ; U14.1 84.72,20.34 v1(84.29,20.76) ; v1(76.11,51.78) 75.68,52.21 U20.1 ; U16.1 76.97,20.34 v1(76.53,20.78) ; U19.1 17.03,20.34 v1(16.6,20.77)
  Power w0.762: v1(8.47,50.9) v1(8.47,51.78) ; v1(8.47,51.78) 7.06,53.19 ; v1(8.47,51.78) 7.06,53.19 ; 7.01,62.44 v1(8.74,64.17) ; 7.01,62.44 7.01,53.19 ; 7.01,62.44 v1(8.74,64.17) ; v1(8.74,64.17) v1(8.74,65.99) ; 14.76,62.5 14.81,62.5 v1(16.48,64.18) v1(16.48,65.99) ; 14.76,62.5 14.76,53.19 ; 14.76,62.5 14.76,53.24 ; 14.76,62.5 16.43,64.18 ; v1(84.13,65.99) v1(84.13,64.18) 82.78,62.83 82.78,53.78 83.87,52.69 v1(83.87,51.76) v1(83.87,50.88) ; v1(91.87,65.99) v1(91.87,64.18) 90.53,62.83 90.53,53.78 91.6,52.7 v1(91.6,51.78) v1(91.6,50.9) ; 7.06,53.19 7.01,53.19 ; 7.01,53.19 7.01,62.49 ; v1(16.23,50.88) v1(16.23,51.76) ; v1(16.23,51.76) 14.76,53.24 ; v1(16.23,51.76) 14.76,53.24 ; v1(76.28,6.55) v1(76.28,8.37) 76.28,20.52 v1(76.53,20.78) v1(76.53,21.67) ; v1(0.84,6.56) v1(0.84,8.37) 0.84,20.5 v1(1.11,20.77) 1,20.87 v1(1,21.64) ; v1(23.96,51.78) 24.04,51.7 v1(24.04,50.9) ; v1(23.96,51.78) 22.53,53.21 ; v1(23.96,51.78) 22.53,53.21 ; 22.53,62.53 24.18,64.18 ; 22.53,62.53 22.58,62.53 v1(24.23,64.18) v1(24.23,65.99) ; 22.53,62.53 22.53,53.21 ; v1(84.29,21.64) v1(84.29,20.76) 84.02,20.49 v1(84.02,8.37) v1(84.02,6.55) ; v1(68.53,6.55) v1(68.53,8.37) 68.53,20.49 v1(68.8,20.76) v1(68.8,21.64) ; v1(16.33,6.56) v1(16.33,8.38) 16.33,20.5 v1(16.6,20.77) 16.52,20.84 v1(16.52,21.64) ; 22.53,53.21 22.53,53.16 ; v1(8.58,6.56) v1(8.58,8.37) 8.58,20.53 v1(8.84,20.78) 8.79,20.83 v1(8.79,21.67) ; v1(76.11,50.9) v1(76.11,51.78) 74.96,52.93 74.96,62.75 v1(76.38,64.17) v1(76.38,65.99)
  Bottom Layer w0.635: 33.31,11.24 33.31,12.02 34.09,12.02 34.09,11.24 ; U11.3 U11.2
  Bottom Layer w0.762: 77.66,22.11 76.97,22.11 v1(76.53,21.67) ; v1(68.8,21.64) 69.27,22.11 69.91,22.11 ; v1(8.79,21.67) 9.23,22.11 9.96,22.11 ; 2.22,22.11 1.48,22.11 v1(1,21.64) ; 75,50.43 75.64,50.43 v1(76.11,50.9) ; v1(91.6,50.9) 91.13,50.43 90.49,50.43 ; 85.4,22.11 84.76,22.11 v1(84.29,21.64) ; v1(83.87,50.88) 83.43,50.43 82.75,50.43 ; v1(16.23,50.88) 15.79,50.43 15.11,50.43 ; v1(8.47,50.9) 8,50.43 7.36,50.43 ; 17.71,22.11 16.99,22.11 v1(16.52,21.64) ; v1(24.04,50.9) 23.57,50.43 22.85,50.43
  Bottom Layer w1.27: 33.68,14.94 33.68,12.22 33.66,12.19
  vias: v1(16.33,4.58) v1(16.33,2.5) v1(24.94,6.6) v1(25.04,14.4) v1(25.04,9.14) v1(25.29,67.86) v1(25.29,66.15) v1(25.29,64.45) v1(25.29,62.75) v1(25.29,61.05) v1(25.29,59.35) v1(25.37,19.71) v1(25.51,1.97) v1(25.79,4.9) v1(25.91,16.71) v1(26.32,14.37) v1(26.8,18.24) v1(26.99,66.15) v1(26.99,64.45) v1(26.99,62.75) v1(26.99,61.05) v1(26.99,59.35) v1(27.18,19.89) v1(27.3,16.33) v1(27.51,21.44) v1(27.56,15.06) v1(27.53,4.93) v1(27.69,17.22) v1(27.61,2.69) v1(27.93,18.55) v1(27.94,13.79) v1(28.69,64.45) v1(28.69,62.75) v1(28.69,61.05) v1(28.69,59.35) v1(28.83,13.28) v1(29.46,19) v1(29.46,13.92) v1(29.45,1.71) v1(29.97,13.03) v1(30.07,20.88) v1(30.38,62.61) v1(30.38,61.34) v1(30.38,60.07) v1(30.38,58.8) v1(30.38,57.53) v1(30.38,56.26) v1(30.38,53.72) v1(30.99,19) v1(31.65,62.61) v1(31.65,61.34) v1(31.65,60.07) v1(31.65,58.8) v1(31.65,57.53) v1(31.65,56.26) v1(31.65,53.72) v1(31.68,14.61) v1(31.75,28.5) v1(31.75,24.69) v1(31.75,20.88) v1(32.39,18.36) v1(32.61,19.81) v1(32.92,61.34) v1(32.92,60.07) v1(32.92,58.8) v1(32.92,57.53) v1(32.92,56.26) v1(32.92,53.72) v1(33.02,15.95) v1(33.02,3.63) v1(33.27,17.98) v1(33.27,16.84) v1(34.19,60.07) v1(34.19,58.8) v1(34.19,57.53) v1(34.19,56.26) v1(34.19,54.99) v1(34.19,53.72) v1(35.23,1.42) v1(35.56,28.5) v1(35.56,24.69) v1(36.2,3.53) v1(38.35,1.32) v1(39.62,3.83) v1(42.09,1.57) v1(43.98,3.33) v1(45.85,1.6) v1(47.47,3.12) v1(49.1,1.6) v1(51.03,2.56) v1(63.58,64.11) v1(63.58,62.41) v1(63.58,60.71) v1(63.58,59) v1(63.58,57.3) v1(65.28,65.81) v1(65.28,64.11) v1(65.28,62.41) v1(65.28,60.71) v1(65.28,59) v1(65.28,57.3) v1(65.56,12.7) v1(66.4,11.66) v1(66.32,9.96) v1(66.78,14.4) v1(66.98,67.51) v1(66.98,65.81) v1(66.98,64.11) v1(66.98,62.41) v1(66.98,60.71) v1(66.98,59) v1(66.98,57.3) v1(66.98,55.6) v1(67.08,8.79) v1(67.23,12.98) v1(68.53,5.45) v1(68.53,3.71) v1(68.53,2.19) v1(76.28,5.1) v1(76.28,3.9) v1(76.28,2.47) v1(76.28,1.13) v1(76.38,71.26) v1(76.38,69.5) v1(76.38,67.67) v1(84.02,4.49) v1(84.02,2.76) v1(84.02,1.11) v1(84.13,71.16) v1(84.13,69.43) v1(84.13,67.6) v1(91.87,71.37) v1(91.87,69.68) v1(91.87,68.09)
+5V: length 64.5
  Top Layer w0.635: H2.2 40.13,22.02 38.21,23.94 38.21,35.21 38.63,35.63 38.63,37.97 43.97,43.31 45.19,43.31 45.52,43.64 45.52,46 45.87,46.36 45.87,47.1 ; U29.3 45.87,47.1 ; 45.87,47.1 47.76,47.1 49.99,49.33 51.74,49.33 v1(52.91,48.16)
  Top Layer w1.016: U25.1 50.8,8.98 C1.2
  Top Layer w1.27: U34.2 48.64,8.53 U25.1
  Power w0.635: 48.13,6.68 45.34,9.47 45.34,14.3 40.13,19.51 H2.2
  Bottom Layer w0.254: U30.3 54.79,47.77 C107.2
  Bottom Layer w0.635: v1(52.91,48.16) U30.3
GND: length 311
  Top Layer w0.254: U2.6 46.36,34.41 47.79,32.97 v1(48.01,32.97) ; U2.7 46.96,35.15 C27.1 ; v1(54.27,35.31) 54.22,35.26 C77.1 54.06,34.4 U33.74 ; C93.1 62.95,14.95 62.5,15.4 62.5,15.63 C92.1 62.56,16.47 U33.19 ; U4.12 46.35,27.74 v1(46.08,28.02) 46.73,28.02 ; U33.99 52,19.84 51.21,19.84 50.89,20.15 v1(50.47,20.15) ; C80.1 57.62,16.41 58.06,16.85 U33.10 58.07,17.81 v1(58.07,19.1) ; 65.15,39.03 64.69,39.48 C28.2 ; 65.15,39.03 C29.2 65.73,38.45 U3.7 65.73,37.22 66.38,36.57 U3.1 66.46,36.18 v1(67.01,36.73) ; 65.15,39.03 65.53,39.42 v1(65.53,39.52) ; U29.1 46.33,49.82 C108.1 ; v1(66.42,18.62) 66.42,18.66 U33.26 ; U2.11 50.24,37.02 C25.1 49.63,36.31 C106.2 48.48,36.02 U2.9 ; U33.49 68.29,30.85 v1(68.45,30.69) ; U4.3 46.73,28.02 ; 46.73,28.02 U4.2 47.62,27.77 C53.1 ; C109.1 48.1,49.99 48.1,50.11 49.06,51.07 49.54,51.07 50.1,50.52 v1(53.87,50.52)
  Top Layer w0.381: v1(50.47,20.15) 50.47,19.34 C81.1 ; C94.2 52.53,16.29 v1(53.56,16.29)
  Top Layer w0.508: R81.2 65.15,9.03 USB3.A12 ; Q24.3 3.61,17.71 v1(3.76,17.86) ; 17.22,35.32 18.17,35.32 v1(18.36,35.13) ; v1(11.51,17.86) 11.36,17.71 Q19.3 ; Q13.3 79.05,17.71 v1(79.2,17.86) ; R39.2 84.48,46.56 v1(84,46.56) ; C109.1 47.47,49.37 U29.1 ; v1(5.82,48.46) 6.32,47.96 U7.7 ; v1(13.56,54.69) 13.71,54.84 14.86,54.84 ; v1(71.58,24.08) 70.94,24.71 U13.7 ; 16.74,46.56 R26.2 16.74,46.56 ; 16.74,46.56 16.31,46.56 ; 16.74,46.56 v1(16.36,46.56) ; v1(6.71,37.41) 6.9,37.22 7.85,37.22 ; v1(19.25,24.08) 18.75,24.59 18.75,26.14 17.73,27.16 R70.2 ; C66.1 76.06,36.93 R75.2 ; v1(79.2,23.95) 78.69,24.46 U16.7 78.69,26.77 R51.2 ; 5.82,54.69 5.97,54.84 7.12,54.84 ; 74.76,54.84 73.61,54.84 v1(73.46,54.69) ; v1(73.46,48.46) 73.96,47.96 U20.7 73.96,46.41 74.98,45.39 R13.2 ; C52.2 44.64,29.88 v1(44.04,30.48) ; U10.7 14.07,48.08 v1(13.56,48.59) ; 89.46,47.07 89.46,47.83 v1(88.82,48.46) ; R10.2 16.67,35.59 C61.1 ; R25.2 14.02,45.82 14.02,47.07 ; v1(71.45,17.86) 71.3,17.71 Q18.3 ; v1(73.08,39.45) 73.08,40.68 C89.2 C2.1 ; 5.44,40.68 v1(5.44,39.45) ; v1(8.71,25.99) 8.23,25.99 R69.2 ; v1(86.94,17.86) 86.79,17.71 Q16.3 ; v1(88.95,54.69) 89.1,54.84 90.25,54.84 ; v1(3.89,24.08) 3.25,24.72 U17.7 ; 58.45,7.55 58.56,7.65 R82.1 ; 21.31,54.69 21.46,54.84 22.61,54.84 ; 9.1,36.91 8.39,36.91 C22.1 ; v1(74.35,37.41) 74.54,37.22 75.49,37.22 ; R53.2 85.57,27.35 86.44,26.49 U14.7 86.44,24.59 v1(86.94,24.08) ; v1(21.18,48.46) 21.82,47.83 U1.7 ; C110.1 47.22,45.87 v1(47.37,46.02) ; Q22.3 19.1,17.71 v1(19.25,17.86) ; v1(11.51,23.96) 11,24.46 11,26.8 R68.2 ; C10.1 C12.2 19.66,31.84 v1(19.66,33.33) ; v1(81.2,48.59) 81.71,48.08 U21.7 81.71,45.74 R37.2 ; v1(86.05,35.13) 85.86,35.32 84.91,35.32 ; R33.2 43.02,24.6 v1(42.71,24.3) ; C8.1 5.4,40.72 5.35,40.72 5.39,40.68 ; R27.2 7.26,45.39 6.27,46.38 6.27,47.07 ; 82.51,54.84 81.35,54.84 v1(81.2,54.69) ; v1(76.4,25.98) 75.74,26.64 R52.2 ; 87.36,30.56 87.36,31.83 87.33,31.86 v1(87.33,33.1) ; R3.2 83.59,35.6 84.44,35.6 84.91,35.13 C40.1
  Top Layer w0.635: v1(39.62,35.76) 40.42,34.96 U32.8 ; U32.9 27.63,36.7 26.82,35.89 23.22,35.89 22.38,35.05 20.85,35.05 v1(20.14,35.76) ; v1(56.81,36.58) 56.96,36.43 C115.1
  Top Layer w0.889: 58.45,7.55 58.13,7.55 USB3.1 ; USB3.A12 65.47,7.55 USB3.2
  Top Layer w1.016: U32.10 22.24,29.57 v1(20.85,29.57) ; U25.2 50.97,11.28 C1.1 ; 37.59,20.9 CN1.1
  Top Layer w1.778: U25.4 U25.2
  Bottom Layer w0.254: C116.1 67.56,30.62 68.38,30.62 v1(68.45,30.69) 67.98,31.15 C78.1 ; v1(50.57,48.28) 50.31,48.54 FPC1.23 ; C79.1 66.59,18.62 v1(66.42,18.62) ; v1(64.14,30.17) 64.47,29.84 U27.1 ; C113.2 58.85,21.35 59.73,22.22 C112.2 ; v1(47.37,46.02) 47.37,46.68 R77.1 ; U31.4 v1(61.14,24.33) ; FPC1.10 43.81,47.88 C103.1 44.48,47.48 v1(45.07,46.89) 45.77,46.89 C105.1
  Bottom Layer w0.508: 77.13,37.36 74.4,37.36 v1(74.35,37.41) ; U9.16 15.65,45.85 v1(16.36,46.56) 17.62,46.56 ; v1(44.04,30.48) 44.54,29.99 C51.2 ; 17.62,46.56 C31.2 17.62,46.56 ; 17.62,46.56 16.31,46.56 ; R9.1 12.43,54.69 v1(13.56,54.69) ; v1(11.51,17.86) 12.64,17.86 R63.1 ; 22.85,49.03 22.28,48.46 v1(21.18,48.46) 20.72,48.93 R18.2 ; 21.31,54.69 20.18,54.69 R4.1 ; R30.1 87.82,54.69 v1(88.95,54.69) ; U15.32 86,35.18 v1(86.05,35.13) ; R64.1 20.39,17.86 v1(19.25,17.86) ; U11.4 36.91,12.19 37.48,12.76 37.48,14.44 37.42,14.5 ; C43.2 75.81,26.58 v1(76.4,25.98) 77.11,26.69 U15.16 ; R47.1 88.08,17.86 v1(86.94,17.86) ; v1(73.46,54.69) 72.32,54.69 R21.1 ; C107.1 v1(52.82,46.32) U30.1 50.86,48.28 v1(50.57,48.28) ; 77.66,23.51 78.1,23.95 v1(79.2,23.95) 79.55,23.6 R54.2 ; 75,49.03 74.43,48.46 v1(73.46,48.46) 73.03,48.89 R14.2 ; R24.1 80.07,54.69 v1(81.2,54.69) ; 17.71,23.51 18.28,24.08 v1(19.25,24.08) 19.68,23.65 R72.2 ; R38.2 80.67,49.12 v1(81.2,48.59) 82.3,48.59 82.75,49.03 ; v1(3.76,17.86) 4.89,17.86 R58.1 ; 69.91,23.51 70.48,24.08 v1(71.58,24.08) 71.93,23.72 R50.2 ; v1(79.2,17.86) 80.33,17.86 R46.1 ; R31.2 13.16,49 v1(13.56,48.59) 14.66,48.59 15.11,49.03 ; 5.82,54.69 4.68,54.69 R15.1 ; C114.2 39.71,25.17 39.67,25.14 39.67,25.02 v1(39.27,24.61) ; R40.2 88.82,48.9 v1(88.82,48.46) 89.92,48.46 90.49,49.03 ; U18.16 83.29,45.85 v1(84,46.56) 85.31,46.56 C63.2 ; v1(18.36,35.13) 18.31,35.18 15.58,35.18 ; U23.16 9.42,26.7 v1(8.71,25.99) 8.4,26.3 6.81,26.3 ; v1(71.45,17.86) 72.58,17.86 R41.1 ; 5.28,49.4 5.28,49 v1(5.82,48.46) 6.79,48.46 7.36,49.03 ; v1(6.71,37.41) 6.76,37.36 9.44,37.36 6.71,37.36 6.66,37.41 ; 85.4,23.51 85.97,24.08 v1(86.94,24.08) 87.3,23.72 R55.2 ; 2.22,23.51 2.79,24.08 v1(3.89,24.08) 3.89,23.65 R67.2 ; 9.96,23.51 10.41,23.96 v1(11.51,23.96) 12.04,23.42 R71.2 ; R74.2 66.71,25.88 v1(65.76,25.88)
  Bottom Layer w0.635: U27.12 57.87,37.5 56.95,36.58 v1(56.81,36.58) 56.46,36.58 55.67,37.37 U27.10 ; C100.1 54.85,27.33 v1(54.85,28.08)
  Bottom Layer w0.762: 32.08,8.42 32.08,6.66
  Bottom Layer w1.016: FPC1.25 52.5,51.89 v1(53.87,50.52) 54.67,50.52 v1(54.71,50.56) ; v1(38.2,49.37) 38,49.57 38,51.6 FPC1.26
  Bottom Layer w1.27: v1(63.32,19.74) 64.11,18.95 C120.2 64.11,17.01 v1(62.54,15.44) 62.13,15.44 v1(61.72,15.85) ; C99.2 52.41,16.29 v1(53.56,16.29)
  vias: v1(3.56,17.15) v1(3.58,16.41) v1(4.27,16.74) v1(4.42,18.32) v1(4.51,17.4) v1(5.08,55.14) v1(5.77,54.69) v1(5.92,55.55) v1(8.18,54.77) v1(8.26,55.67) v1(8.97,54.86) v1(8.99,53.31) v1(9.03,56.16) v1(11.33,17.07) v1(11.81,16.46) v1(12.17,17.25) v1(12.27,18.34) v1(12.83,55.14) v1(13.66,55.55) v1(15.93,54.77) v1(16.01,55.67) v1(16.77,56.16) v1(16.71,54.86) v1(16.74,53.31) v1(19.05,17.15) v1(19.15,16.44) v1(19.79,16.84) v1(19.99,18.37) v1(20.06,17.48) v1(20.32,32.69) v1(20.57,55.14) v1(20.94,33.33) v1(21.26,54.69) v1(21.41,55.55) v1(21.56,30.17) v1(21.64,32.69) v1(23.67,54.77) v1(23.76,55.67) v1(24.49,53.31) v1(24.54,56.21) v1(32.08,7.65) v1(35.13,17.6) v1(35.15,15.82) v1(35.84,18.54) v1(36.75,12.95) v1(37.8,13.66) v1(39.37,13) v1(39.5,14.55) v1(39.79,18.37) v1(40.51,15.7) v1(40.77,17.09) v1(41.02,14.45) v1(41.35,12.6) v1(41.91,15.7) v1(42.16,18.87) v1(42.9,13.66) v1(43.18,17.98) v1(44.07,17.09) v1(45.08,16.2) v1(49.28,37.03) v1(49.66,31.32) v1(59.01,21.5) v1(62.31,50.21) v1(62.31,48.94) v1(62.31,47.67) v1(62.31,46.4) v1(63.58,46.4) v1(64.85,48.94) v1(64.85,47.67) v1(64.85,46.4) v1(71.25,17.14) v1(71.27,16.41) v1(71.96,16.74) v1(72.11,18.31) v1(72.2,17.4) v1(72.77,55.14) v1(73.61,55.55) v1(75.87,54.77) v1(75.95,55.67) v1(76.66,54.86) v1(76.68,53.31) v1(76.72,56.16) v1(79.02,17.07) v1(79.5,16.46) v1(79.86,17.25) v1(79.96,18.34) v1(80.52,55.14) v1(81.35,55.55) v1(83.7,55.67) v1(83.62,54.77) v1(84.4,54.86) v1(84.47,56.16) v1(84.43,53.31) v1(86.74,17.14) v1(86.84,16.43) v1(87.48,16.84) v1(87.68,18.36) v1(87.76,17.47) v1(88.27,55.14) v1(89.1,55.55) v1(91.52,55.62) v1(91.59,54.74) v1(91.8,53.9) v1(92.01,56.26)
VDDA: length 4.4
  Top Layer w0.254: L4.2 C93.2 C92.2 63.79,16.44 63.56,16.67 U33.21
$1I45090\$1N2345: length 7.7
  Top Layer w0.508: U22.3 88.19,53.67 v1(88.44,53.92)
  Bottom Layer w0.508: Q5.1 90.24,54.82 89.34,53.92 v1(88.44,53.92)
$1I45090\$1N2351: length 11.6
  Top Layer w1.016: 77.93,54.84 77.93,50.69 78.89,49.73 81.79,49.73 82.98,48.54 U21.8
$1I45090\$1N2355: length 2.7
  Top Layer w0.508: U21.2 81.71,51.49 v1(81.09,50.88)
  Bottom Layer w0.508: C69.2 81.09,51.55 v1(81.09,50.88)
$1I45090\$1N2357: length 7.7
  Top Layer w0.508: U21.3 80.44,53.67 v1(80.7,53.92)
  Bottom Layer w0.508: v1(80.7,53.92) 81.59,53.92 82.49,54.82 Q3.1
$1I45090\$1N2360: length 11.6
  Top Layer w1.016: U20.8 75.23,48.54 74.04,49.73 71.15,49.73 70.19,50.69 70.19,54.84
$1I45090\$1N2369: length 2.7
  Top Layer w0.508: v1(73.35,50.88) 73.96,51.49 U20.2
  Bottom Layer w0.508: v1(73.35,50.88) 73.35,51.55 C67.2
$1I45090\$1N2370: length 7.7
  Top Layer w0.508: v1(72.95,53.92) 72.69,53.67 U20.3
  Bottom Layer w0.508: v1(72.95,53.92) 73.85,53.92 74.74,54.82 Q1.1
$1I45090\$1N2388: length 3
  Top Layer w0.508: R36.2 77.73,41.6 v1(77.14,41.01)
  Bottom Layer w0.508: 75.69,41.2 76.94,41.2 v1(77.14,41.01)
$1I45090\$1N2393: length 2.7
  Top Layer w0.508: 89.46,52.21 89.46,51.49 v1(88.84,50.88)
  Bottom Layer w0.508: v1(88.84,50.88) 88.84,51.55 C71.2
$1I45090\$1N2396: length 11.6
  Top Layer w1.016: 85.68,54.84 85.68,50.69 86.64,49.73 89.54,49.73 90.73,48.54 U22.8
$1I45090\$1N2406: length 7.7
  Top Layer w0.508: L3.1 73.94,40.65 C89.1 C2.2 76.76,41.99 v1(77.14,42.37)
  Bottom Layer w0.508: 75.69,42 76.78,42 v1(77.14,42.37)
$1I45090\A_REF: length 30.6
  Bottom Layer w0.508: R29.1 83.14,54.06 82.29,53.21 78.77,53.21 R23.1 75.39,54.06 74.55,53.21 71.02,53.21 R20.1 70.17,48.57 72.19,46.56 76.63,46.56 77.13,46.05 77.13,45.85
$1I45090\AU: length 21.1
  Power w0.508: v1(70.41,47.07) 70.66,47.32 v1(70.66,56.59)
  Bottom Layer w0.508: R20.2 R21.2 R19.1 71.06,56.98 70.94,56.86 70.94,56.86 v1(70.66,56.59) ; v1(70.41,47.07) 73.3,44.17 73.3,43.71 74.21,42.8 75.69,42.8
$1I45090\AV: length 20.1
  Power w0.508: v1(78.41,56.59) 78.41,54.14 77.67,53.4 77.67,48.1 74.22,44.65 v1(74.22,44.02)
  Bottom Layer w0.508: R23.2 R24.2 R22.1 78.8,56.98 78.69,56.86 78.68,56.86 v1(78.41,56.59) ; v1(74.22,44.02) 74.63,43.6 75.69,43.6
$1I45090\AW: length 23
  Power w0.508: v1(77.77,43.64) 77.77,43.65 85.41,51.28 85.41,53.4 86.16,54.14 v1(86.16,56.59)
  Bottom Layer w0.508: v1(77.77,43.64) 77.72,43.69 77.23,43.69 76.51,44.4 75.69,44.4 ; v1(86.16,56.59) 86.43,56.86 86.43,56.86 86.55,56.98 R28.1 R30.2 R29.2
$1I45090\BOOT0_ESC: length 5
  Top Layer w0.508: v1(77.39,39.32) 77.85,38.87 U35.2 78.33,37.82 R75.1
  Bottom Layer w0.508: v1(77.39,39.32) 77.93,38.78 U18.31
$1I45090\PHASE_U: length 9.9
  Top Layer w0.508: v1(71.95,50.88) 71.42,51.4 U20.4 71.42,53.14 71.68,53.4 71.68,55.56 72.47,56.35 72.47,57 v1(72.82,57.35)
  Bottom Layer w0.508: C67.1 71.95,51.68 v1(71.95,50.88) ; R19.2 71.66,58.52 Q1.3
  vias: v1(72.7,58.14) v1(73.56,58.11) v1(73.58,57.23)
$1I45090\PHASE_V: length 9.9
  Top Layer w0.508: v1(80.57,57.35) 80.22,57 80.22,56.35 79.42,55.56 79.42,53.4 79.17,53.14 U21.4 79.17,51.4 v1(79.7,50.88)
  Bottom Layer w0.508: R22.2 79.41,58.52 Q3.3 ; 79.91,51.89 79.7,51.68 v1(79.7,50.88)
  vias: v1(80.44,58.14) v1(81.31,58.11) v1(81.33,57.23)
$1I45090\PHASE_W: length 9.9
  Top Layer w0.508: v1(87.44,50.88) 86.92,51.4 U22.4 86.92,53.14 87.17,53.4 87.17,55.56 87.97,56.35 87.97,57 v1(88.32,57.35)
  Bottom Layer w0.508: C71.1 87.44,51.68 v1(87.44,50.88) ; Q5.3 87.16,58.52 R28.2
  vias: v1(88.19,58.14) v1(89.05,58.11) v1(89.08,57.23)
$1I45090\UH: length 11
  Top Layer w0.508: v1(71.93,48.59) 71.42,48.08 U20.5
  Bottom Layer w0.508: U18.11 78.73,46.56 77.89,47.4 73.13,47.4 v1(71.93,48.59) 72.16,48.82 72.16,49.45
$1I45090\UL: length 8
  Top Layer w0.508: U20.6 72.69,46.05 73.71,45.03 74.32,45.03 74.83,44.53 v1(77.52,44.53)
  Bottom Layer w0.508: U18.10 77.93,44.94 v1(77.52,44.53)
$1I45090\USART1_RX: length 6.3
  Bottom Layer w0.508: H1.3 87.03,42 U18.20
$1I45090\USART1_TX: length 5.6
  Bottom Layer w0.508: U18.19 88.77,42.8 H1.2
$1I45090\VH: length 5.7
  Top Layer w0.508: U21.5 79.17,48.08 v1(79.68,48.59)
  Bottom Layer w0.508: 79.81,49.45 79.81,48.72 v1(79.68,48.59) 80.33,47.94 U18.13
$1I45090\VL: length 4.3
  Top Layer w0.508: v1(79.68,44.47) 80.44,45.23 U21.6
  Bottom Layer w0.508: U18.12 79.53,44.62 v1(79.68,44.47)
$1I45090\WH: length 9.2
  Top Layer w0.508: U22.5 86.92,48.21 v1(86.49,48.64)
  Bottom Layer w0.508: U18.15 81.93,46.73 82.52,47.32 85.22,47.32 86.46,48.56 86.46,48.62 v1(86.49,48.64) 86.54,48.64 R40.1
$1I45090\WL: length 9.9
  Top Layer w0.508: U22.6 88.19,46.3 86.92,45.03 82.98,45.03 82.35,44.4 v1(81.46,44.4)
  Bottom Layer w0.508: 81.13,45.85 81.13,44.72 v1(81.46,44.4)
$1I45112\$1N2345: length 7.7
  Top Layer w0.508: v1(20.8,53.92) 20.55,53.67 U1.3
  Bottom Layer w0.508: v1(20.8,53.92) 20.85,53.97 21.82,53.97 22.6,54.75 Q8.1
$1I45112\$1N2351: length 11.6
  Top Layer w1.016: 10.29,54.84 10.29,50.69 11.25,49.73 14.15,49.73 15.34,48.54 U10.8
$1I45112\$1N2355: length 3.9
  Top Layer w0.508: v1(13.45,50.88) 14.07,51.49 U10.2
  Bottom Layer w0.508: 13.45,51.5 v1(13.45,50.88) 13.45,51.5 ; 13.45,51.5 C24.2 13.4,51.55
$1I45112\$1N2357: length 7.8
  Top Layer w0.508: v1(13.06,53.92) 12.8,53.67 U10.3
  Bottom Layer w0.508: Q9.1 14.85,54.7 14.12,53.97 13.11,53.97 v1(13.06,53.92)
$1I45112\$1N2360: length 11.6
  Top Layer w1.016: 2.55,54.84 2.55,50.69 3.51,49.73 6.4,49.73 7.59,48.54 U7.8
$1I45112\$1N2369: length 3.9
  Top Layer w0.508: U7.2 6.32,51.49 v1(5.71,50.88)
  Bottom Layer w0.508: 5.71,51.5 C7.2 5.66,51.55 ; 5.71,51.5 v1(5.71,50.88) 5.71,51.5
